# Altium project Soldier.PrjPcb (part 1 of 2)
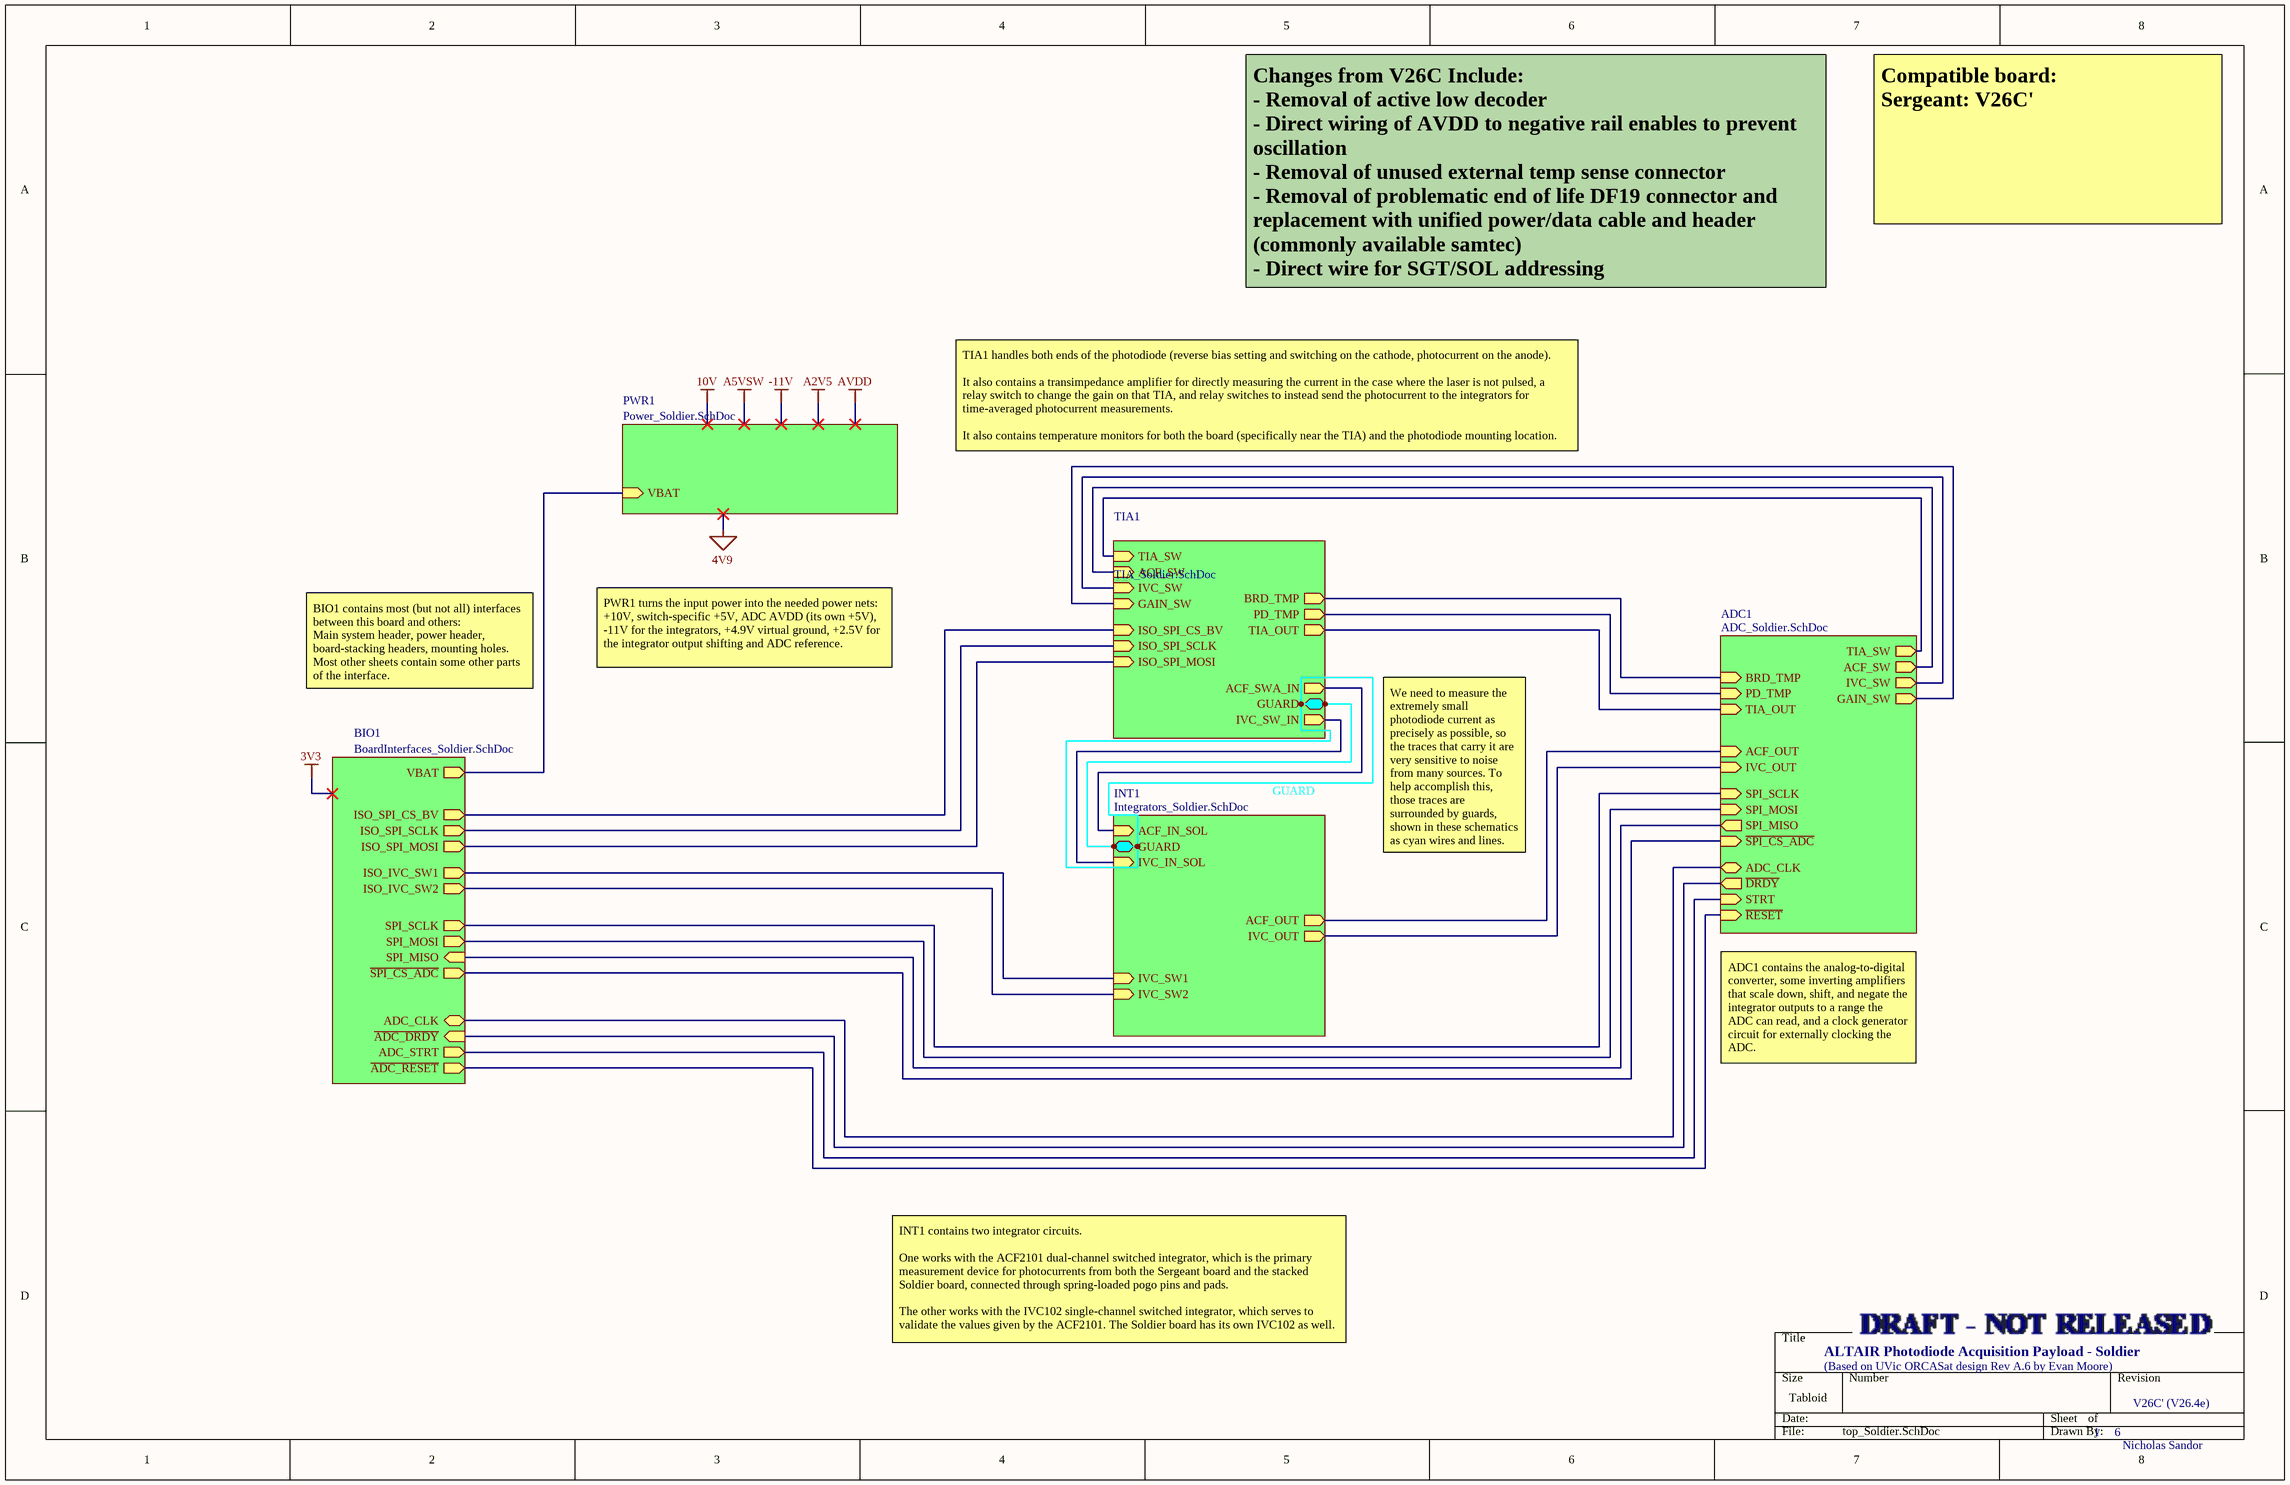
[diagram p0: top_Soldier.SchDoc]
Revision: V26C' (V26.4e); DrawnBy: Nicholas Sandor
6 sheets, 191 parts. Net scope: hierarchical (ports join the sheet entries above them; power ports are global).
Board file: ALTAIR_PD_Soldier_V26.4c.PcbDoc
Sheets:
  top_Soldier.SchDoc
    PWR1 = Power_Soldier.SchDoc
    BIO1 = BoardInterfaces_Soldier.SchDoc
    TIA1 = TIA_Soldier.SchDoc
    INT1 = Integrators_Soldier.SchDoc
    ADC1 = ADC_Soldier.SchDoc

## Sheet top_Soldier.SchDoc
size Tabloid; SheetNumber: 1; SheetTotal: 6

### Sub-sheets
ADC1 = ADC_Soldier.SchDoc: PD_TMP (in), BRD_TMP (in), TIA_OUT (in), ~{SPI_CS_ADC} (in), STRT (in), ACF_OUT (in), IVC_OUT (in), SPI_MOSI (in), SPI_SCLK (in), SPI_MISO (out), ~{DRDY} (out), ~{RESET} (in), ADC_CLK (bidir), GAIN_SW (out), IVC_SW (out), ACF_SW (out), TIA_SW (out)
BIO1 = BoardInterfaces_Soldier.SchDoc: VBAT (out), ADC_CLK (bidir), ~{ADC_DRDY} (in), ADC_STRT (out), ~{ADC_RESET} (out), ISO_SPI_CS_BV (out), ISO_SPI_SCLK (out), ISO_SPI_MOSI (out), ~{SPI_CS_ADC} (out), SPI_MISO (in), SPI_MOSI (out), SPI_SCLK (out), ISO_IVC_SW2 (out), ISO_IVC_SW1 (out)
INT1 = Integrators_Soldier.SchDoc: ACF_IN_SOL (in), IVC_IN_SOL (in), GUARD (bidir), IVC_SW1 (in), IVC_SW2 (in), IVC_OUT (out), ACF_OUT (out)
PWR1 = Power_Soldier.SchDoc: VBAT (in)
TIA1 = TIA_Soldier.SchDoc: IVC_SW_IN (out), ACF_SWA_IN (out), TIA_OUT (out), BRD_TMP (out), PD_TMP (out), GUARD (bidir), TIA_SW (in), ACF_SW (in), IVC_SW (in), GAIN_SW (in), ISO_SPI_CS_BV (in), ISO_SPI_SCLK (in), ISO_SPI_MOSI (in)

### Nets
~{DRDY2}: sheet BIO1/~{ADC_DRDY}, sheet ADC1/~{DRDY}
~{SPI_CS2}: sheet BIO1/~{SPI_CS_ADC}, sheet ADC1/~{SPI_CS_ADC}
ACF_SWA_IN: sheet TIA1/ACF_SWA_IN, sheet INT1/ACF_IN_SOL
ADC_CLK: sheet BIO1/ADC_CLK, sheet ADC1/ADC_CLK
GUARD: sheet TIA1/GUARD, sheet INT1/GUARD
IVC_SW_IN: sheet TIA1/IVC_SW_IN, sheet INT1/IVC_IN_SOL
rSPI_MOSI: sheet BIO1/SPI_MOSI, sheet ADC1/SPI_MOSI
rSPI_SCLK: sheet BIO1/SPI_SCLK, sheet ADC1/SPI_SCLK
SPI_MISO: sheet BIO1/SPI_MISO, sheet ADC1/SPI_MISO
STRT2: sheet BIO1/ADC_STRT, sheet ADC1/STRT
TIA_OUT: sheet TIA1/TIA_OUT, sheet ADC1/TIA_OUT
VBAT: sheet PWR1/VBAT, sheet BIO1/VBAT
NetC32_2: sheet TIA1/BRD_TMP, sheet ADC1/BRD_TMP
NetJ6_3: sheet TIA1/PD_TMP, sheet ADC1/PD_TMP
NetJ9_1: sheet INT1/ACF_OUT, sheet ADC1/ACF_OUT
NetR1_2: sheet BIO1/~{ADC_RESET}, sheet ADC1/~{RESET}
NetR36_2: sheet TIA1/ACF_SW, sheet ADC1/ACF_SW
NetR38_2: sheet TIA1/TIA_SW, sheet ADC1/TIA_SW
NetR39_2: sheet TIA1/IVC_SW, sheet ADC1/IVC_SW
NetR42_2: sheet TIA1/GAIN_SW, sheet ADC1/GAIN_SW
NetU9_1: sheet BIO1/ISO_SPI_CS_BV, sheet TIA1/ISO_SPI_CS_BV
NetU9_2: sheet BIO1/ISO_SPI_SCLK, sheet TIA1/ISO_SPI_SCLK
NetU9_3: sheet BIO1/ISO_SPI_MOSI, sheet TIA1/ISO_SPI_MOSI
NetU12_11: sheet BIO1/ISO_IVC_SW2, sheet INT1/IVC_SW2
NetU12_12: sheet BIO1/ISO_IVC_SW1, sheet INT1/IVC_SW1
NetU15_10: sheet INT1/IVC_OUT, sheet ADC1/IVC_OUT

### Notes on the sheet
- Compatible board:
  Sergeant: V26C'
- Changes from V26C Include:
  - Removal of active low decoder
  - Direct wiring of AVDD to negative rail enables to prevent oscillation
  - Removal of unused external temp sense connector
  - Removal of problematic end of life DF19 connector and replacement with unified power/data cable and header (commonly available samtec)
  - Direct wire for SGT/SOL addressing
- TIA1 handles both ends of the photodiode (reverse bias setting and switching on the cathode, photocurrent on the anode).
  It also contains a transimpedance amplifier for directly measuring the current in the case where the laser is not pulsed, a relay switch to change the gain on that TIA, and relay switches to instead send the photocurrent to the integrators for time-averaged photocurrent measurements.
  It also contains temperature monitors for both the board (specifically near the TIA) and the photodiode mounting location.
- BIO1 contains most (but not all) interfaces between this board and others:
  Main system header, power header, board-stacking headers, mounting holes.
  Most other sheets contain some other parts of the interface.
- PWR1 turns the input power into the needed power nets:
  +10V, switch-specific +5V, ADC AVDD (its own +5V), -11V for the integrators, +4.9V virtual ground, +2.5V for the integrator output shifting and ADC reference.
- GUARD
- We need to measure the extremely small photodiode current as precisely as possible, so the traces that carry it are very sensitive to noise from many sources. To help accomplish this, those traces are surrounded by guards, shown in these schematics as cyan wires and lines.
- ADC1 contains the analog-to-digital converter, some inverting amplifiers that scale down, shift, and negate the integrator outputs to a range the ADC can read, and a clock generator circuit for externally clocking the ADC.
- INT1 contains two integrator circuits.
  One works with the ACF2101 dual-channel switched integrator, which is the primary measurement device for photocurrents from both the Sergeant board and the stacked Soldier board, connected through spring-loaded pogo pins and pads.
  The other works with the IVC102 single-channel switched integrator, which serves to validate the values given by the ACF2101. The Soldier board has its own IVC102 as well.
- ALTAIR Photodiode Acquisition Payload - Soldier
- (Based on UVic ORCASat design Rev A.6 by Evan Moore)

## Sheet Power_Soldier.SchDoc
size Tabloid; SheetNumber: 3; SheetTotal: 6
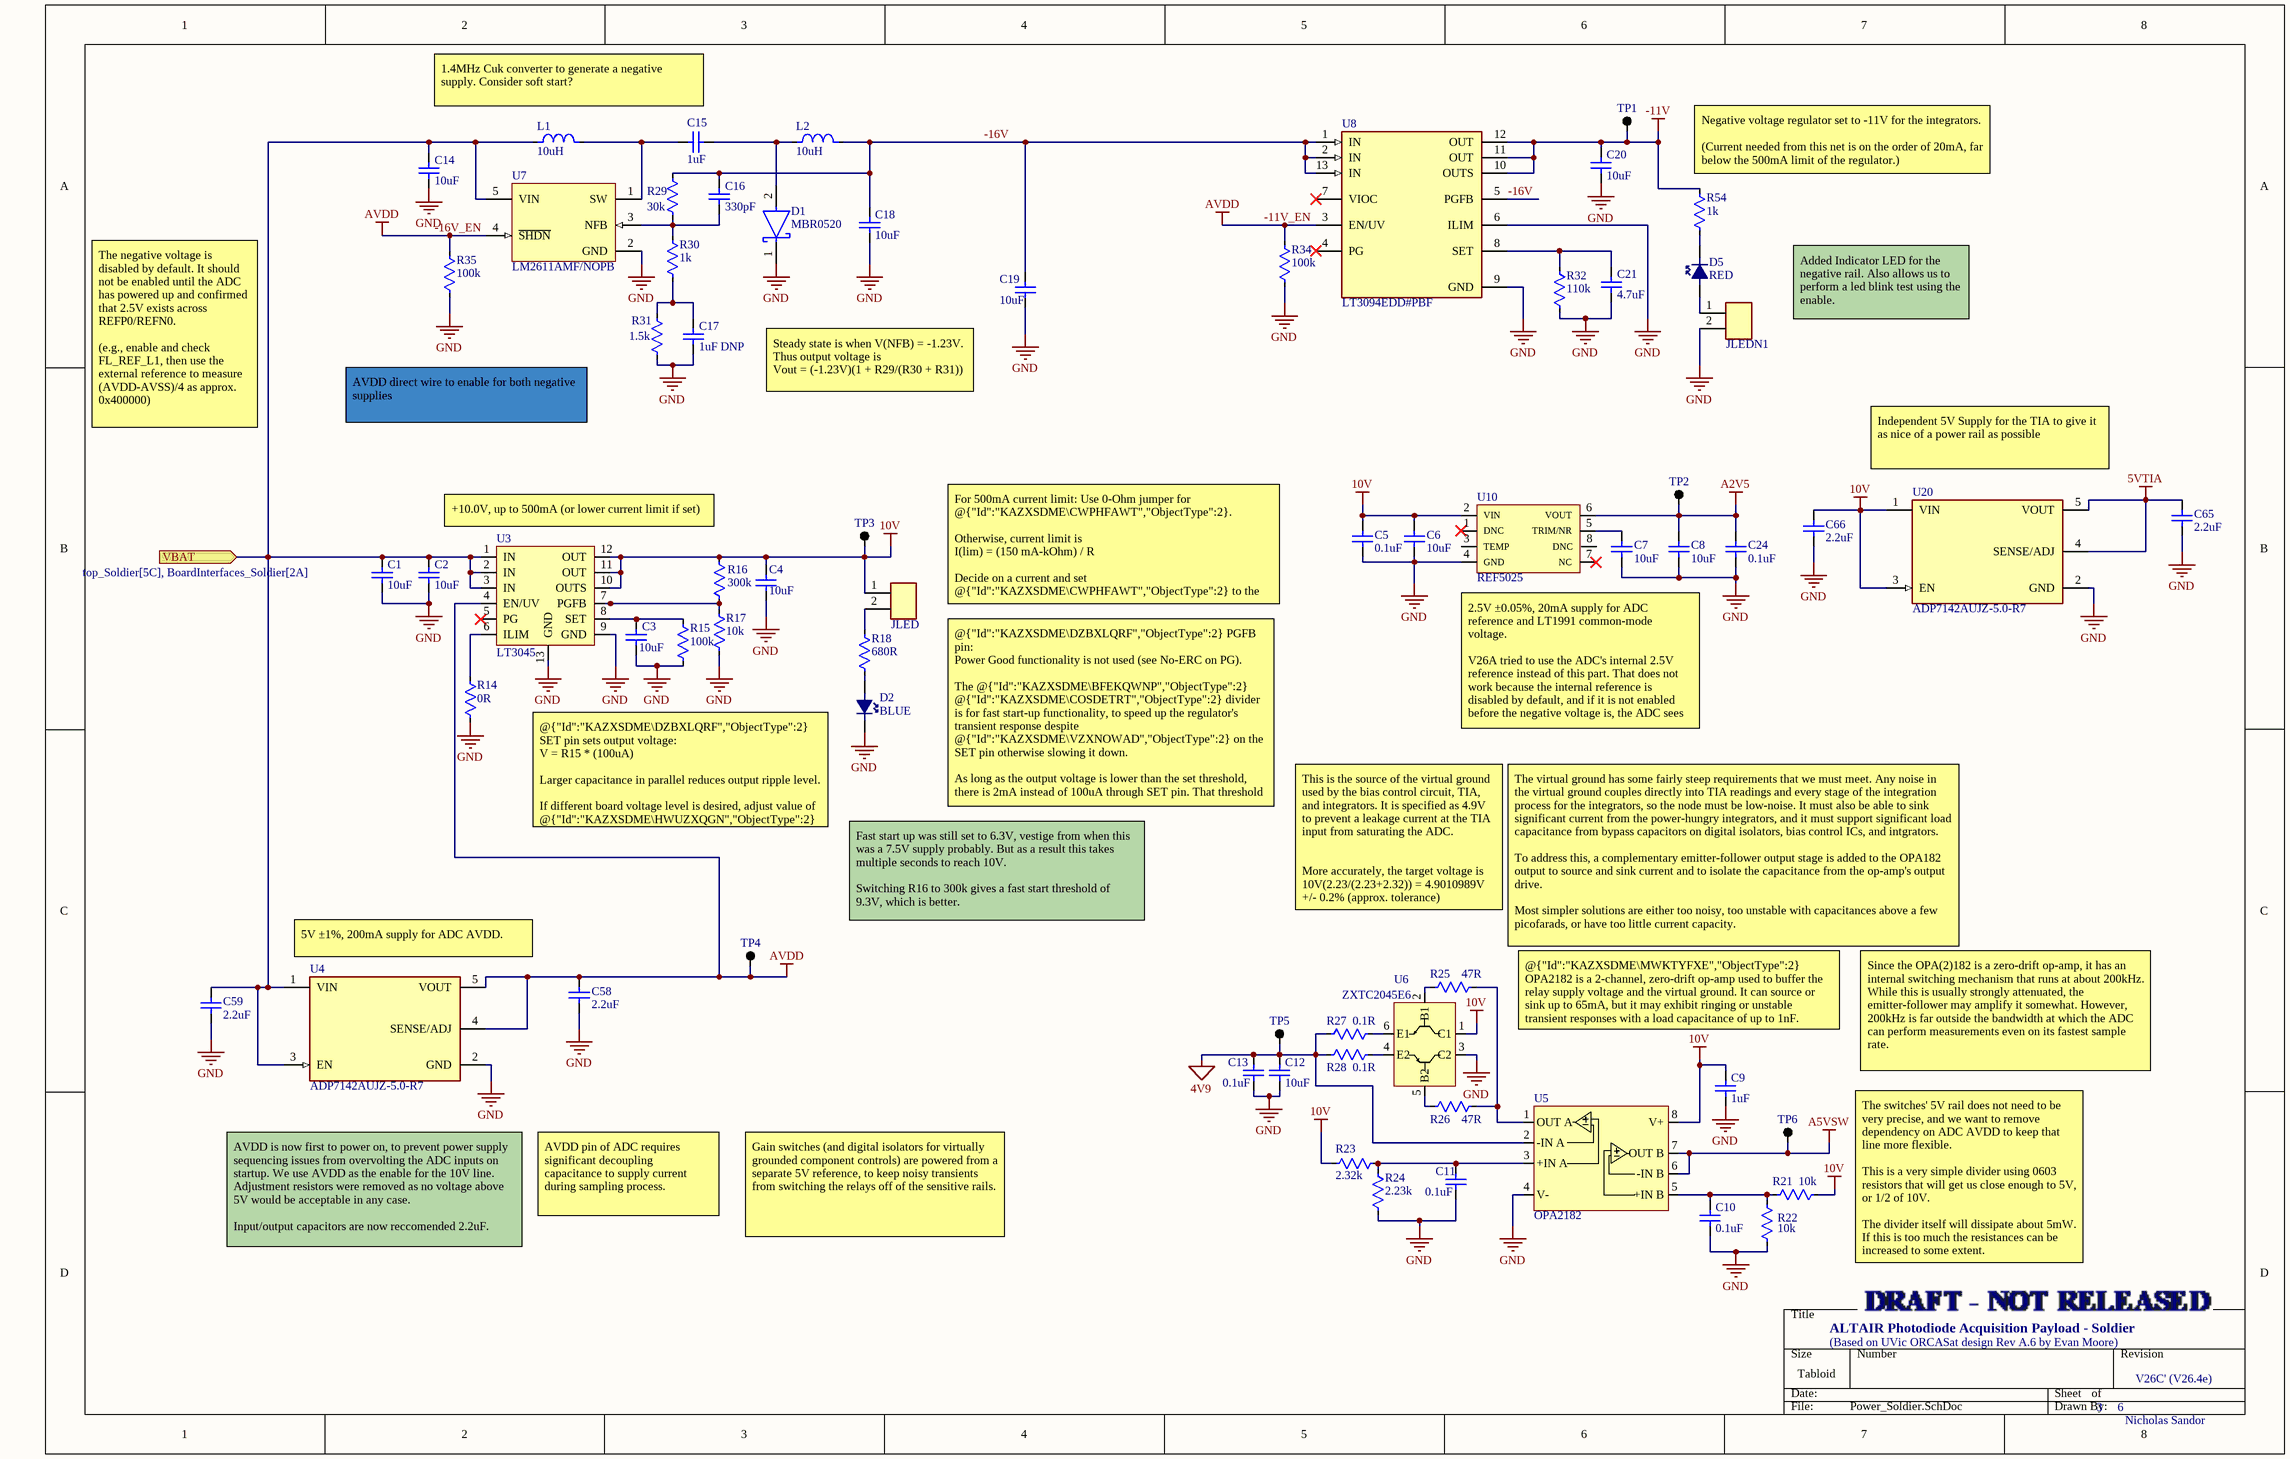
[diagram p1: Power_Soldier.SchDoc]

### Parts
C1  10uF  [CAP 1206 IPC LOW DENSITY]
C2  10uF  [CAP 1206 IPC LOW DENSITY]
C3  10uF  [CAP 1206 IPC LOW DENSITY]
C4  10uF  [CAP 1206 IPC LOW DENSITY]
C5  0.1uF  [CAP 0603 IPC MID DENSITY]
C6  10uF  [CAP 0805 IPC MID DENSITY]
C7  10uF  [CAP 0805 IPC MID DENSITY]
C8  10uF  [CAP 0805 IPC MID DENSITY]
C9  1uF  [CAP 0603 IPC MID DENSITY]
C10  0.1uF  [CAP 0603 IPC MID DENSITY]
C11  0.1uF  [CAP 0603 IPC MID DENSITY]
C12  10uF  [CAP 1206 IPC LOW DENSITY]
C13  0.1uF  [CAP 0603 IPC MID DENSITY]
C14  10uF  [CAP 0805 IPC MID DENSITY]
C15  1uF  [CAP 0603 IPC MID DENSITY]
C16  330pF  [CAP 1206 NON-IPC KEMET NP0]
C17  1uF DNP  [CAP 0603 IPC MID DENSITY]
C18  10uF  [CAP 0805 IPC MID DENSITY]
C19  10uF  [CAP 0805 IPC MID DENSITY]
C20  10uF  [CAP 0805 IPC MID DENSITY]
C21  4.7uF  [CAP 0805 NON-IPC KEMET X5R]
C24  0.1uF  [CAP 0603 IPC MID DENSITY]
C58  2.2uF  [CAP 1206 UNKNOWN]
C59  2.2uF  [CAP 1206 UNKNOWN]
C65  2.2uF  [CAP 1206 UNKNOWN]
C66  2.2uF  [CAP 1206 UNKNOWN]
D1  MBR0520  [SOD-123 ONSEMI SMALL PADS]
D2  BLUE  [LED 0603 MID DENSITY]
D5  RED  [LED 0603 MID DENSITY]
JLED  JLED  [JUMPER 2POS 1MM PITCH THT]  (value not drawn)
JLEDN1  JLED  [JUMPER 2POS 1MM PITCH THT]  (value not drawn)
L1  10uH  [IND VLS3012CX-1 NONSTANDARD TDK]
L2  10uH  [IND VLS3012CX-1 NONSTANDARD TDK]
R14  0R  [RES 0603 IPC MID DENSITY]
R15  100k  [RES 0603 IPC MID DENSITY]
R16  300k  [RES 0603 IPC MID DENSITY]
R17  10k  [RES 0603 IPC MID DENSITY]
R18  680R  [RES 0603 IPC MID DENSITY]
R21  10k  [RES 0603 IPC MID DENSITY]
R22  10k  [RES 0603 IPC MID DENSITY]
R23  2.32k  [RES 0603 IPC MID DENSITY]
R24  2.23k  [RES 0603 IPC MID DENSITY]
R25  47R  [RES 0402 NON-IPC SEI]
R26  47R  [RES 0402 NON-IPC SEI]
R27  0.1R  [RES 0402 NON-IPC YAGEO]
R28  0.1R  [RES 0402 NON-IPC YAGEO]
R29  30k  [RES 0805 IPC HIGH DENSITY]
R30  1k  [RES 0402 IPC LOW DENSITY YAGEO]
R31  1.5k  [RES 1206 NON-IPC VISHAY]
R32  110k  [RES 0603 IPC MID DENSITY]
R34  100k  [RES 0603 IPC MID DENSITY]
R35  100k  [RES 0603 IPC MID DENSITY]
R54  1k  [RES 0603 IPC MID DENSITY]
TP1  Testpoint  [TESTPOINT THT]  (value not drawn)  (no BOM)
TP2  Testpoint  [TESTPOINT THT]  (value not drawn)  (no BOM)
TP3  Testpoint  [TESTPOINT THT]  (value not drawn)  (no BOM)
TP4  Testpoint  [TESTPOINT THT]  (value not drawn)  (no BOM)
TP5  Testpoint  [TESTPOINT THT]  (value not drawn)  (no BOM)
TP6  Testpoint  [TESTPOINT THT]  (value not drawn)  (no BOM)
U3  LT3045  [12-TSOP 0.65MM PITCH 3MM WIDTH EP IPC MID DENSITY]
U4  ADP7142AUJZ-5.0-R7  [SOT23-5 HIGH DENSITY AD]
U5  OPA2182  [8-TSSOP 0.65MM PITCH 4.4MM WIDTH IPC MID DENSITY]
U6  ZXTC2045E6  [SOT23-6 NON-IPC DIODES]
U7  LM2611AMF/NOPB  [SOT23-5 MID DENSITY]
U8  LT3094EDD#PBF  [12DFN 3x3MM EP IPC MID DENSITY]
U10  REF5025  [8-TSOP 0.65MM PITCH 3MM WIDTH IPC MID DENSITY]
U20  ADP7142AUJZ-5.0-R7  [SOT23-5 HIGH DENSITY AD]

### Ports
VBAT (in, see top_Soldier[5C], BoardInterfaces_Soldier[2A])

### Nets
4V9: C12.2 C13.2 R27.1 R28.1 TP5.1 U5.2(-IN_A)
5VTIA: C65.1 U20.4(SENSE/ADJ) U20.5(VOUT)
10V: C4.2 C5.1 C6.2 C9.2 C66.1 JLED.1 R16.2 R21.2 R23.2 TP3.1 U3.10(OUTS) U3.11(OUT) U3.12(OUT) U5.8(V+) U6.1(C1) U10.2(VIN) U20.1(VIN) U20.3(EN)
-11V: C20.1 R54.2 TP1.1 U8.10(OUTS) U8.11(OUT) U8.12(OUT)
-11V_EN: C58.1 R34.1 R35.1 TP4.1 U3.4(EN/UV) U4.4(SENSE/ADJ) U4.5(VOUT) U7.4(~{SHDN}) U8.3(EN/UV)  [also labelled -16V_EN, AVDD]
A2V5: C8.2 C24.1 TP2.1 U10.6(VOUT)
A5VSW: TP6.1 U5.6(-IN_B) U5.7(OUT_B)
GND: C1.1 C2.1 C3.1 C4.1 C5.2 C6.1 C7.2 C8.1 C9.1 C10.1 C11.1 C12.1 C13.1 C14.1 C17.2 C18.2 C19.2 C20.2 C21.2 C24.2 C58.2 C59.2 C65.2 C66.2 D1.1(C) D2.1 JLEDN1.2 R14.1 R15.1 R17.1 R22.1 R24.1 R31.1 R32.2 R34.2 R35.2 U3.9(GND) U3.13(GND) U4.2(GND) U5.4(V-) U6.3(C2) U7.2(GND) U8.6(ILIM) U8.9(GND) U10.4(GND) U20.2(GND)  [project net SYS_GND]
-16V: C16.1 C18.1 C19.1 L2.2 R29.2 U8.1(IN) U8.2(IN) U8.5(PGFB) U8.13(IN)
VBAT: C1.2 C2.2 C14.2 C59.1 L1.1 U3.1(IN) U3.2(IN) U3.3(IN) U4.1(VIN) U4.3(EN) U7.5(VIN) ; port VBAT
NetC3_2: C3.2 R15.2 U3.8(SET)
NetC7_1: C7.1 U10.5(TRIM/NR)
NetC10_2: C10.2 R21.1 R22.2 U5.5(+IN_B)
NetC11_2: C11.2 R23.1 R24.2 U5.3(+IN_A)
NetC15_1: C15.1 L1.2 U7.1(SW)
NetC15_2: C15.2 D1.2(A) L2.1
NetC16_2: C16.2 R29.1 R30.2 U7.3(NFB)
NetC17_1: C17.1 R30.1 R31.2
NetC21_1: C21.1 R32.1 U8.8(SET)
NetD2_2: D2.2 R18.1
NetD5_1: D5.1 R54.1
NetD5_2: D5.2 JLEDN1.1
NetJLED_2: JLED.2 R18.2
NetR14_2: R14.2 U3.6(ILIM)
NetR16_1: R16.1 R17.2 U3.7(PGFB)
NetR25_1: R25.1 U6.2(B1)
NetR25_2: R25.2 R26.2 U5.1(OUT_A)
NetR26_1: R26.1 U6.5(B2)
NetR27_2: R27.2 U6.6(E1)
NetR28_2: R28.2 U6.4(E2)

Not connected (* = marked no-connect by the designer): U3 5(PG)*; U8 4(PG)* 7(VIOC)*; U10 1(DNC)* 3(TEMP) 7(NC)* 8(DNC)

### Notes on the sheet
- 1.4MHz Cuk converter to generate a negative supply. Consider soft start?
- (near R54) Negative voltage regulator set to -11V for the integrators.
  (Current needed from this net is on the order of 20mA, far below the 500mA limit of the regulator.)
- Added Indicator LED for the negative rail. Also allows us to perform a led blink test using the enable.
- The negative voltage is disabled by default. It should not be enabled until the ADC has powered up and confirmed that 2.5V exists across REFP0/REFN0.
  (e.g., enable and check FL_REF_L1, then use the external reference to measure (AVDD-AVSS)/4 as approx. 0x400000)
- AVDD direct wire to enable for both negative supplies
- Steady state is when V(NFB) = -1.23V.
  Thus output voltage is
  Vout = (-1.23V)(1 + R29/(R30 + R31))
- (near U20) Independent 5V Supply for the TIA to give it as nice of a power rail as possible
- +10.0V, up to 500mA (or lower current limit if set)
- For 500mA current limit: Use 0-Ohm jumper for @{"Id":"KAZXSDME\CWPHFAWT","ObjectType":2}.
  Otherwise, current limit is
  I(lim) = (150 mA-kOhm) / R
  Decide on a current and set @{"Id":"KAZXSDME\CWPHFAWT","ObjectType":2} to the found value of R.
- 2.5V ±0.05%, 20mA supply for ADC reference and LT1991 common-mode voltage.
  V26A tried to use the ADC's internal 2.5V reference instead of this part. That does not work because the internal reference is disabled by default, and if it is not enabled before the negative voltage is, the ADC sees dangerously negative voltages on analog inputs.
- @{"Id":"KAZXSDME\DZBXLQRF","ObjectType":2} SET pin sets output voltage:
  V = R15 * (100uA)
  Larger capacitance in parallel reduces output ripple level.
  If different board voltage level is desired, adjust value of @{"Id":"KAZXSDME\HWUZXQGN","ObjectType":2} as necessary according to the above equation.
- @{"Id":"KAZXSDME\DZBXLQRF","ObjectType":2} PGFB pin:
  Power Good functionality is not used (see No-ERC on PG).
  The @{"Id":"KAZXSDME\BFEKQWNP","ObjectType":2} @{"Id":"KAZXSDME\COSDETRT","ObjectType":2} divider is for fast start-up functionality, to speed up the regulator's transient response despite @{"Id":"KAZXSDME\VZXNOWAD","ObjectType":2} on the SET pin otherwise slowing it down.
  As long as the output voltage is lower than the set threshold, there is 2mA instead of 100uA through SET pin. That threshold is
  V(PG) = (0.3V)(1 + R16/R17) - I(PGFB) R56
  Where I(PGFB) is on the order of 1E-8 A.
- (near U4) 5V ±1%, 200mA supply for ADC AVDD.
- Fast start up was still set to 6.3V, vestige from when this was a 7.5V supply probably. But as a result this takes multiple seconds to reach 10V.
  Switching R16 to 300k gives a fast start threshold of 9.3V, which is better.
- This is the source of the virtual ground used by the bias control circuit, TIA, and integrators. It is specified as 4.9V to prevent a leakage current at the TIA input from saturating the ADC.
  More accurately, the target voltage is 10V(2.23/(2.23+2.32)) = 4.9010989V +/- 0.2% (approx. tolerance)
- The virtual ground has some fairly steep requirements that we must meet. Any noise in the virtual ground couples directly into TIA readings and every stage of the integration process for the integrators, so the node must be low-noise. It must also be able to sink significant current from the power-hungry integrators, and it must support significant load capacitance from bypass capacitors on digital isolators, bias control ICs, and intgrators.
  To address this, a complementary emitter-follower output stage is added to the OPA182 output to source and sink current and to isolate the capacitance from the op-amp's output drive.
  Most simpler solutions are either too noisy, too unstable with capacitances above a few picofarads, or have too little current capacity.
- @{"Id":"KAZXSDME\MWKTYFXE","ObjectType":2} OPA2182 is a 2-channel, zero-drift op-amp used to buffer the relay supply voltage and the virtual ground. It can source or sink up to 65mA, but it may exhibit ringing or unstable transient responses with a load capacitance of up to 1nF.
- Since the OPA(2)182 is a zero-drift op-amp, it has an internal switching mechanism that runs at about 200kHz. While this is usually strongly attenuated, the emitter-follower may amplify it somewhat. However, 200kHz is far outside the bandwidth at which the ADC can perform measurements even on its fastest sample rate.
- AVDD pin of ADC requires significant decoupling capacitance to supply current during sampling process.
- AVDD is now first to power on, to prevent power supply sequencing issues from overvolting the ADC inputs on startup. We use AVDD as the enable for the 10V line. Adjustment resistors were removed as no voltage above 5V would be acceptable in any case.
  Input/output capacitors are now reccomended 2.2uF.
- Gain switches (and digital isolators for virtually grounded component controls) are powered from a separate 5V reference, to keep noisy transients from switching the relays off of the sensitive rails.
- (near R21) The switches' 5V rail does not need to be very precise, and we want to remove dependency on ADC AVDD to keep that line more flexible.
  This is a very simple divider using 0603 resistors that will get us close enough to 5V, or 1/2 of 10V.
  The divider itself will dissipate about 5mW. If this is too much the resistances can be increased to some extent.
- ALTAIR Photodiode Acquisition Payload - Soldier
- (Based on UVic ORCASat design Rev A.6 by Evan Moore)

### Library data of the parts
C1-C4 C12 = CAP: Murata GRT319R6YA106KE01D - Cap Ceramic 10uF 35V X5R 10% Pad SMD 1206 85C Automotive T/R; MF: Murata; MP: GRT319R6YA106KE01D
C5 C10 C11 C13 C24 = CAP: Kemet C0603C104K5RACAUTO - Cap Ceramic 0.1uF 50V X7R 10% 0603 125C Paper T/R; MF: Kemet; MP: C0603C104K5RACAUTO
C6-C8 C14 C18-C20 = CAP: Murata GRM21BR61E106KA73L - Cap Ceramic 10uF 10% 25V X5R 0805; MF: Murata; MP: GRM21BR61E106KA73L
C9 C15 C17 = CAP: Murata GRT188R61H105KE13D - Cap MLCC AEC-Q200 X5R 1uF 50V 0603; MF: Murata; MP: GRT188R61H105KE13D
C16 = CAP: Kemet C1206C331J5GACTU - Cap Ceramic 330pF 50V 5% NP0 1206; MF: Kemet; MP: C1206C331J5GACTU
C21 = CAP: Kemet C0805C475K8PACTU - Cap Ceramic 4.7uF 10V X5R 0805; MF: Kemet; MP: C0805C475K8PACTU
C58 C59 C65 C66 = CAP: CL31B225KBHNNNE CAP CER 2.2UF 50V X7R 1206; MF: Samsung Electro-Mechanics; MP: CL31B225KBHNNNE
D1 = Schottky: DIODE SCHOTTKY 20V 500MA SOD123; Polarity: Standard; Peak Non-Repetitive Surge Current: 5.5A; Forward Voltage: 385mV; Element Configuration: Single; Peak Reverse Current: 250uA; MF: onsemi; MP: MBR0520LT1G; Max Repetitive Reverse Voltage (Vrrm): 20V; Voltage Rating (DC): 20V; Case/Package: SOD-123-2; Number of Pins: 2; Output Current: 500mA; Min Operating Temperature: -65°C; Lead Free: Lead Free; REACH SVHC: No SVHC; Max Reverse Voltage (DC): 20V; Termination: SMD/SMT; Average Rectified Current: 500mA; Max Surge Current: 5.5A; Package Quantity: 3000; Height: 1.12mm; Current Rating: 500mA; Forward Current: 500mA; Max Forward Surge Current (Ifsm): 5.5A; Packaging: Tape and Reel; Length: 2.69mm; Radiation Hardening: No; Max Reverse Leakage Current: 250uA; Width: 1.6mm; Contact Plating: Tin; Max Operating Temperature: 125°C
D2 = LED-blue: LED BLUE CLEAR 0603 SMD; Luminous Intensity: 145mcd; Forward Current: 30mA; Forward Voltage: 3.2V; Wavelength: 470nm; Viewing Angle: 140°; Lens Style: Clear,Rectangular; Test Current: 20mA; MF: Wurth Electronics; MP: 150060BS75000; RoHS: Yes; Category: LEDs; Stock 1: 66561; Mount: Surface Mount; Case/Package: 0603; Color: Blue; Case Code (Metric): 1608; Case Code (Imperial): 0603; Min Operating Temperature: -40°C; Max Operating Temperature: 85°C; Package Quantity: 4000; Packaging: Cut Tape; Dominant Wavelength: 470nm; Length: 1.6mm; Height: 0.7mm; Width: 0.8mm; REACH SVHC: Unknown; ComponentLink1URL: https://datasheet.ciiva.com/29563/150060bs75000-29563034.pdf?src-supplier=Digi-Key; ComponentLink1Description: https://datasheet.ciiva.com/29563/150060bs75000-29563034.pdf?src-supplier=Digi-Key; ComponentLink2URL: https://datasheet.ciiva.com/29279/759426-da-01-en-chipled-0603-w-kl-blau-150060bs75000-29279193.pdf?src-supplier=Conrad; ComponentLink2Description: https://datasheet.ciiva.com/29279/759426-da-01-en-chipled-0603-w-kl-blau-150060bs75000-29279193.pdf?src-supplier=Conrad; ComponentLink3URL: https://datasheet.ciiva.com/29563/150060bs75000-29563035.pdf?src-supplier=Digi-Key; ComponentLink3Description: https://datasheet.ciiva.com/29563/150060bs75000-29563035.pdf?src-supplier=Digi-Key; ComponentLink4URL: https://datasheet.ciiva.com/29563/150060bs75000-29563036.pdf?src-supplier=Digi-Key; ComponentLink4Description: https://datasheet.ciiva.com/29563/150060bs75000-29563036.pdf?src-supplier=Digi-Key; ComponentLink5URL: https://datasheet.ciiva.com/22656/1911343-22656939.pdf?src-supplier=Element14; ComponentLink5Description: https://datasheet.ciiva.com/22656/1911343-22656939.pdf?src-supplier=Element14; ComponentLink6URL: https://datasheet.ciiva.com/48430/150060bs75000-eng-tds-48430039.pdf?src-supplier=Distrelec; ComponentLink6Description: https://datasheet.ciiva.com/48430/150060bs75000-eng-tds-48430039.pdf?src-supplier=Distrelec; Supplier 1: Digi-Key; Supplier Part Number 1: 732-4966-1-ND
D5 = LED-blue: LED RED CLEAR 0603 SMD; Color: Blue; Luminous Intensity: 145mcd; Forward Current: 30mA; Forward Voltage: 3.2V; Wavelength: 470nm; Viewing Angle: 140°; Lens Style: Clear,Rectangular; Test Current: 20mA; MF: Wurth Electronics; MP: 150060BS75000; RoHS: Yes; Category: LEDs; Stock 1: 66561; Mount: Surface Mount; Case/Package: 0603; Case Code (Metric): 1608; Case Code (Imperial): 0603; Min Operating Temperature: -40°C; Max Operating Temperature: 85°C; Package Quantity: 4000; Packaging: Cut Tape; Dominant Wavelength: 470nm; Length: 1.6mm; Height: 0.7mm; Width: 0.8mm; REACH SVHC: Unknown; ComponentLink1URL: https://datasheet.ciiva.com/29563/150060bs75000-29563034.pdf?src-supplier=Digi-Key; ComponentLink1Description: https://datasheet.ciiva.com/29563/150060bs75000-29563034.pdf?src-supplier=Digi-Key; ComponentLink2URL: https://datasheet.ciiva.com/29279/759426-da-01-en-chipled-0603-w-kl-blau-150060bs75000-29279193.pdf?src-supplier=Conrad; ComponentLink2Description: https://datasheet.ciiva.com/29279/759426-da-01-en-chipled-0603-w-kl-blau-150060bs75000-29279193.pdf?src-supplier=Conrad; ComponentLink3URL: https://datasheet.ciiva.com/29563/150060bs75000-29563035.pdf?src-supplier=Digi-Key; ComponentLink3Description: https://datasheet.ciiva.com/29563/150060bs75000-29563035.pdf?src-supplier=Digi-Key; ComponentLink4URL: https://datasheet.ciiva.com/29563/150060bs75000-29563036.pdf?src-supplier=Digi-Key; ComponentLink4Description: https://datasheet.ciiva.com/29563/150060bs75000-29563036.pdf?src-supplier=Digi-Key; ComponentLink5URL: https://datasheet.ciiva.com/22656/1911343-22656939.pdf?src-supplier=Element14; ComponentLink5Description: https://datasheet.ciiva.com/22656/1911343-22656939.pdf?src-supplier=Element14; ComponentLink6URL: https://datasheet.ciiva.com/48430/150060bs75000-eng-tds-48430039.pdf?src-supplier=Distrelec; ComponentLink6Description: https://datasheet.ciiva.com/48430/150060bs75000-eng-tds-48430039.pdf?src-supplier=Distrelec; Supplier 1: Digi-Key; Supplier Part Number 1: 732-4966-1-ND
JLED JLEDN1 = BC020-02-A-0200-0300-L-G: 2x1 Header THT 1mm Pitch; MF: GCT (GLOBAL CONNECTOR TECHNOLOGY); Datasheet Link: https://gct.co/connector/bc020; MP: BC020-02-A-0200-0300-L-G; Mouser Part Number: 640-BC02002A02300LG; Mouser Price/Stock: https://www.mouser.co.uk/ProductDetail/GCT/BC020-02-A-0200-0300-L-G?qs=KUoIvG%2F9IlakgsojlT9P9w%3D%3D
L1 L2 = IND: TDK VLS3012CX-100M-1 - Inductor 10uH 20% 1.25A 0.324Ohm NonstandardPkg; DC Resistance (DCR): 324mR; Core Material: Ferrite; Saturation Current: 1A; Test Frequency: 100kHz; MF: TDK Corporation; Inductance: 10uH; Height: 1.20mm; Width: 3.00mm; Inductance Tolerance: 20%; Lead Free: Lead Free; Length: 3.00mm; Max Operating Temperature: 105°C; Resistor Type: Wirewound; Height - Seated (Max): 0.047inch; Series: VLS-CX-1; Packaging: Tape and Reel; Number of Pins: 2; Tolerance: 20%; Mount: Surface Mount; Max DC Current: 1.25A; Min Operating Temperature: -40°C; Termination: SMD/SMT; MP: VLS3012CX-100M-1
R14 = RES: Vishay CRCW06030000Z0EA - Res 0 Ohms 1/8W SMD 0603; MF: Vishay Dale; MP: CRCW06030000Z0EA
R15 = RES: Panasonic ERA-3ARB104V - Res SMD 0603 0.1% 0.10W T.C. 10ppm 100K; MF: Panasonic Electronic Components; MP: ERA-3ARB104V
R16 = RES: Vishay MCT06030C3003FP500 - Res SMD 300kOhm 1% 1/10W 0603; MF: Vishay Dale; MP: MCT06030C3003FP500
R17 R21 R22 = RES: Vishay CRCW060310K0FKEA SMD 0603 10k, CRCW e3 Series, 75V, thick film, 100mW; MF: Vishay Dale; MP: CRCW060310K0FKEA
R18 = RES: Panasonic ERJ-3EKF6800V - Res SMD 680 Ohm 1% 1/10W 0603; MF: Panasonic Electronic Components; MP: ERJ-3EKF6800V
R23 = RES: Vishay TNPW06032K32BEEA - Res 2.32k 0.1% 0.21W SMD 0603; MF: Vishay Dale; MP: TNPW06032K32BEEA
R24 = RES: KOA Speer RN73R1JTTD2231B25 - Res 2.23k 0.1% 1/10W SMD 0603; MF: KOA Speer Electronics, Inc.; MP: RN73R1JTTD2231B25
R25 R26 = RES: Stackpole RMCF0402JT47R0 - Res 47Ohm 5% 0.063W 0402 Thick Film AEC-Q200 compliant; MF: Stackpole Electronics Inc.; MP: RMCF0402JT47R0
R27 R28 = RES: Yageo RL0402JR-070R1L - Res 0.1Ohm 5% 1/16W SMD 0402; MF: YAGEO; MP: RL0402JR-070R1L
R29 = RES: Panasonic ERA-6AEB303V - Res 30kOhm 0.1% 1/8W 0805; MF: Panasonic Electronic Components; MP: ERA-6AEB303V
R30 = RES: Yageo RC0402FR-071KL - Res 1kOhm 1% 1/16W 0402; MF: YAGEO; MP: RC0402FR-071KL
R31 = RES: Vishay TNPU12061K50BZEN00 - Res 1.5kOhm 0.1% 1/4W 1206; MF: Vishay Dale; MP: TNPU12061K50BZEN00
R32 = RES: Panasonic ERA-3AEB114V - Res 110k 0.1% 1/10W SMD 0603; MF: Panasonic Electronic Components; MP: ERA-3AEB114V
R34 R35 = RES: Panasonic ERJ-3GEYJ104V - Res 100k 5% 1/10W SMD 0603; MF: Panasonic Electronic Components; MP: ERJ-3GEYJ104V
R54 = RES: Panasonic ERJ-U03F1001V - Res SMD 1 kOhm 1% 1/10W 0603; MF: Panasonic Electronic Components; MP: ERJ-U03F1001V
U3 = LT3045: 20V 500mA Ultralow Noise Ultrahigh PSRR Adjustable Linear Regulator 260V Dropout MSOP-12; Output Voltage: 15V; Dropout Voltage: 260mV; Number of Regulators: 1; Min Current Limit: 570mA; MF: Analog Devices / Linear Technology; MP: LT3045EMSE#PBF; RoHS: Yes; Stock 1: 1588; Case/Package: MSOP; Min Operating Temperature: -40°C; Max Operating Temperature: 125°C; Output Current: 500mA; ComponentLink1URL: http://www.farnell.com/datasheets/2163219.pdf?src-supplier=Farnell; ComponentLink1Description: http://www.farnell.com/datasheets/2163219.pdf?src-supplier=Farnell; ComponentLink2URL: http://www.linear.com/docs/55649?src-supplier=Digi-Key; ComponentLink2Description: http://www.linear.com/docs/55649?src-supplier=Digi-Key; Supplier 1: Digi-Key; Supplier Part Number 1: LT3045EMSE#PBF-ND
U4 U20 = ADP7142AUJZ-R7: 1.2-40V 200mA Low Noise CMOS LDO Adjustable Linear Regulator TSOT23; Nominal Supply Current: 50-180uA; Output Type: AdjustableProgrammable; Max Supply Voltage: 40V; Number Of Outputs: 1; Dropout Voltage: 200mV; Output Voltage: 1.2-5V; Min Supply Voltage: 2.7V; Max Junction Temp: +150°C; MF: Analog Devices; Accuracy Percentage: 0.8%; Ambient Temperature Range Low: -40°C; ComponentLink2Description: Datasheet; Digikey Description: IC REG LIN POS ADJ 200MA TSOT23; Device Class L1: Integrated Circuits (ICs); Mouser Description: LDO Regulator Pos 1.5V to 5V 0.2A 5-Pin TSOT-23 T/R; Height: 1mm; Temperature Range Low: -40°C; Output Current: 200mA; Device Class L3: Voltage Regulators - Linear; Octopart: https://octopart.com/adp7142aujz-r7-analog+devices-38928114; Category: IC; MP: ADP7142AUJZ-5.0-R7; ComponentLink2URL: https://www.analog.com/media/en/technical-documentation/data-sheets/ADP7142.pdf; Device Class L2: Power Management ICs; Package: UJ-5; Automotive: No; Lead Free: Yes; Ambient Temperature Range High: +125°C; Temperature: -40°C to +125°C; Temperature Range High: +125°C; RoHS: TRUE; Manufacturer: Analog Devices; Manufacturer Part Number: ADP7142AUJZ-R7
U5 = OPA2182IDBV: Op amp, 2 Channel, Highest-precision, 36-V, 5-MHz, single, low-noise, zero-drift, MUX-friendly amplifier 8VSSOP -40 to 125; MF: Texas Instruments; MP: OPA2182IDGKR
U6 = ZXTC2045E6: BJT Array, 1NPN 1PNP, VCE(sat) 375mV, hFE 300, Breakdown 30V, 6-SOT-23; MF: Diodes Incorporated; MP: ZXTC2045E6TA
U7 = LM2611AMF: 1.4MHz Cuk Converter, 5-pin SOT-23, Pb-Free; PowerWise: N; CompType: Switcher; PackageTopMarking: S40A*XTT; MF: Texas Instruments; ComponentLink1URL: http://www.ti.com/general/docs/lit/getliterature.tsp?genericPartNumber=LM2611&fileType=pdf; PackageDescription: Molded SOT-23, .115 x .063 x .040 in Body, 5 Lead, .0375 in Pitch; ComponentLink1Description: Datasheet URL; PackageReference: DBV0005A; PinCount: 5; RoHS: Y; MP: LM2611AMF/NOPB
U8 = LT3094EDD#PBF: -20V 500mA Ultralow Noise Ultrahigh PSRR Adjustable Negative Linear Regulator 12DFN; MF: Analog Devices; RoHS Compliant: Yes; MP: LT3094EDD#PBF
U10 = REF5050IDGKR: 2.5V±0.05% Voltage Reference 8VSSOP; MF: Texas Instruments; MP: REF5025IDGKR; Number of Channels: 1; Max Input Voltage: 18V; Output Voltage: 5V; Min Input Voltage: 5.2V; Nominal Supply Current: 800uA; Tolerance: 0.05%; Max Output Current: 10mA; Operating Supply Current: 1.2mA; Temperature Coefficient: 3ppm/°C; Reference Type: Series; Output Type: Fixed; Supplier 1: Digi-Key; RoHS: Yes; Category: Voltage References; Stock 1: 2539; Pricing 1: 1=6.18000, 10=5.58100, 25=5.32200, 100=4.41320, 250=4.02380, 500=3.76420, 1000=3.45268 (USD); Case/Package: VSSOP; Number of Pins: 8; Weight: 0.00067oz; Min Operating Temperature: -40°C; Max Operating Temperature: 125°C; Packaging: Tape and Reel; Package Quantity: 1; Min Output Voltage: 5V; Output Current: 10mA; Max Output Voltage: 5V; Quiescent Current: 800uA; Radiation Hardening: No; Lead Free: Lead Free; ComponentLink1URL: https://datasheet.ciiva.com/2007/ref5020-2007532.pdf?src-supplier=Digi-Key; ComponentLink1Description: https://datasheet.ciiva.com/2007/ref5020-2007532.pdf?src-supplier=Digi-Key; ComponentLink2URL: https://datasheet.ciiva.com/14197/ref5050-14197084.pdf?src-supplier=Avnet; ComponentLink2Description: https://datasheet.ciiva.com/14197/ref5050-14197084.pdf?src-supplier=Avnet; ComponentLink3URL: https://datasheet.ciiva.com/2007/ref5020-2007533.pdf?src-supplier=Digi-Key; ComponentLink3Description: https://datasheet.ciiva.com/2007/ref5020-2007533.pdf?src-supplier=Digi-Key; ComponentLink4URL: https://datasheet.ciiva.com/2007/ref5020-2007534.pdf?src-supplier=Digi-Key; ComponentLink4Description: https://datasheet.ciiva.com/2007/ref5020-2007534.pdf?src-supplier=Digi-Key; ComponentLink5URL: https://datasheet.ciiva.com/41462/001014471-da-01-en-ic-vref-series-ref5050idgkr-vssop-8-tid-41462326.pdf?src-supplier=Conrad; ComponentLink5Description: https://datasheet.ciiva.com/41462/001014471-da-01-en-ic-vref-series-ref5050idgkr-vssop-8-tid-41462326.pdf?src-supplier=Conrad; Supplier Part Number 1: 296-27505-1-ND

## Sheet BoardInterfaces_Soldier.SchDoc
size Tabloid; SheetNumber: 2; SheetTotal: 6
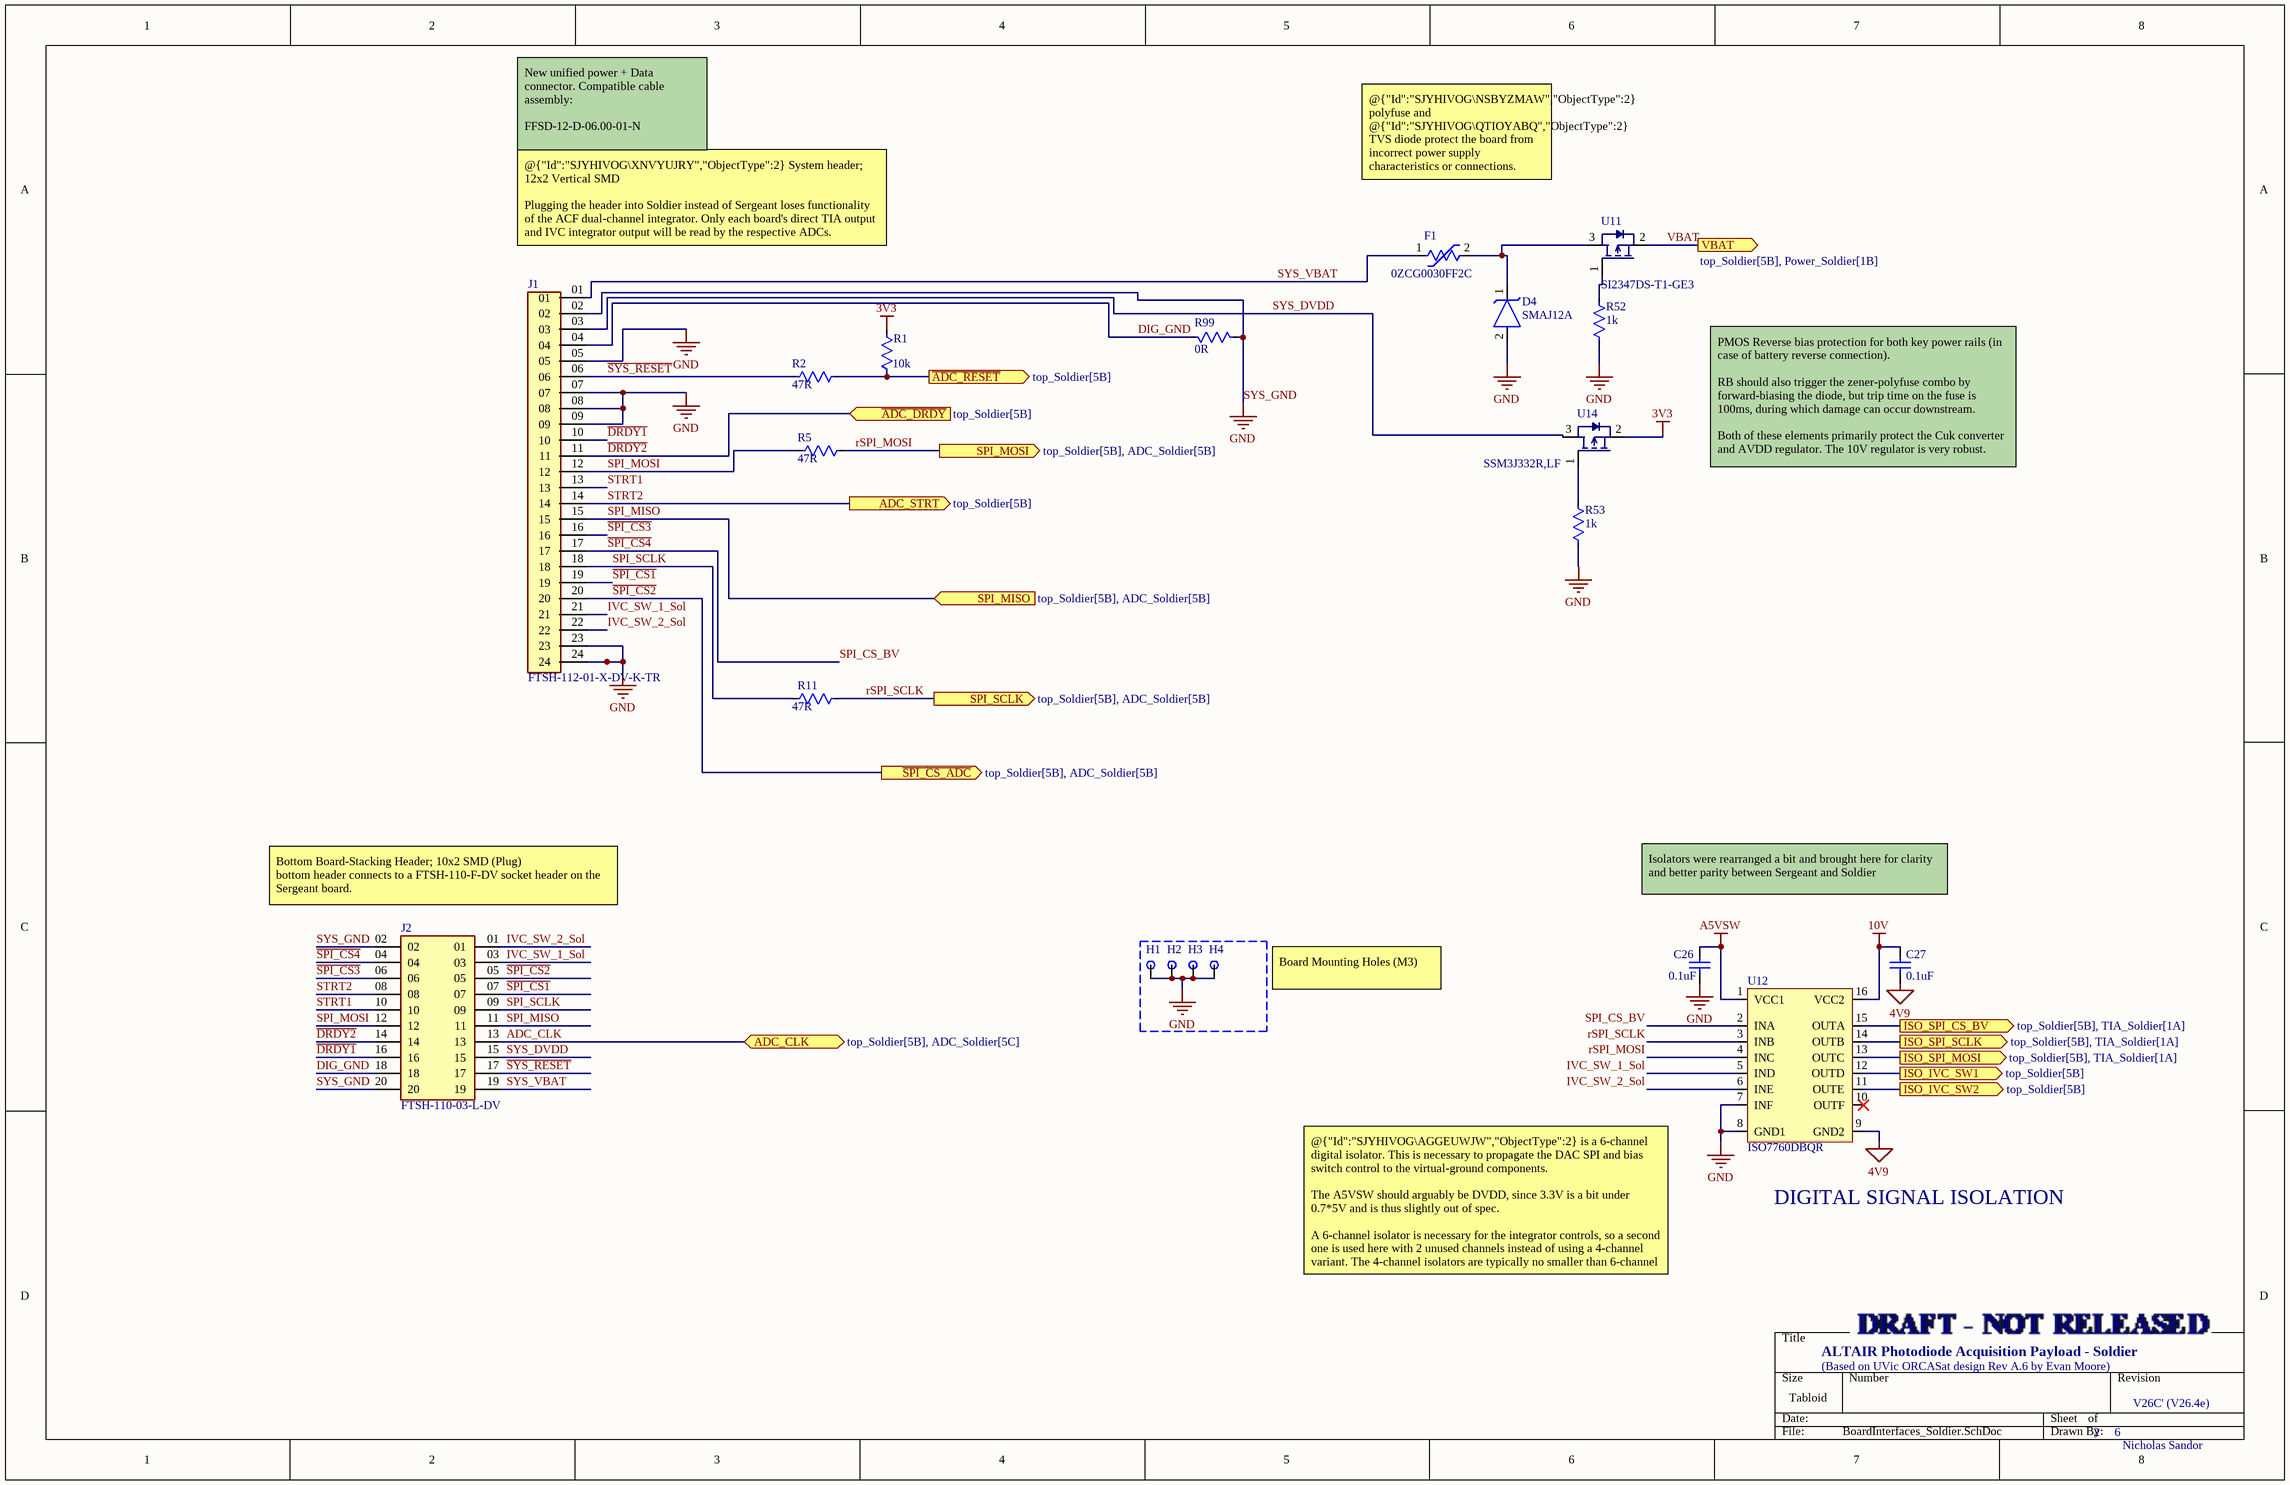
[diagram p2: BoardInterfaces_Soldier.SchDoc]

### Parts
C26  0.1uF  [CAP 0603 IPC MID DENSITY]
C27  0.1uF  [CAP 0603 IPC MID DENSITY]
D4  SMAJ12A  [DO-214AC SMA VISHAY]
F1  0ZCG0030FF2C  [POLYFUSE 1812 NON-IPC BELFUSE]
H1  Mount-hole  [M3 PTH FOR 4.5MM HEX]  (value not drawn)  (no BOM)
H2  Mount-hole  [M3 PTH FOR 4.5MM HEX]  (value not drawn)  (no BOM)
H3  Mount-hole  [M3 PTH FOR 4.5MM HEX]  (value not drawn)  (no BOM)
H4  Mount-hole  [M3 PTH FOR 4.5MM HEX]  (value not drawn)  (no BOM)
J1  FTSH-112-01-X-DV-K-TR  [SAMTEC_FTSH-112-01-X-DV-K-TR]
J2  FTSH-110-03-L-DV  [HEADER MALE 10X2 1.27MM PITCH FTSH]
R1  10k  [RES 0603 IPC MID DENSITY]
R2  47R  [RES 0402 NON-IPC SEI]
R5  47R  [RES 0402 NON-IPC SEI]
R11  47R  [RES 0402 NON-IPC SEI]
R52  1k  [RES 0603 IPC MID DENSITY]
R53  1k  [RES 0603 IPC MID DENSITY]
R99  0R  [RES 0402 IPC MID DENSITY]
U11  SI2347DS-T1-GE3  [SOT95P245X110-3N]
U12  ISO7760DBQR  [16-SSOP 0.635MM PITCH 5.4MM WIDTH NON-IPC TI]
U14  SSM3J332R,LF  [SOT95P245X110-3N]

### Ports
ADC_CLK (bidir, see top_Soldier[5B], ADC_Soldier[5C]), ADC_STRT (out, see top_Soldier[5B]), ISO_IVC_SW1 (out, see top_Soldier[5B]), ISO_IVC_SW2 (out, see top_Soldier[5B]), ISO_SPI_CS_BV (out, see top_Soldier[5B], TIA_Soldier[1A]), ISO_SPI_MOSI (out, see top_Soldier[5B], TIA_Soldier[1A]), ISO_SPI_SCLK (out, see top_Soldier[5B], TIA_Soldier[1A]), SPI_MISO (in, see top_Soldier[5B], ADC_Soldier[5B]), SPI_MOSI (out, see top_Soldier[5B], ADC_Soldier[5B]), SPI_SCLK (out, see top_Soldier[5B], ADC_Soldier[5B]), VBAT (out, see top_Soldier[5B], Power_Soldier[1B]), ~{ADC_DRDY} (in, see top_Soldier[5B]), ~{ADC_RESET} (out, see top_Soldier[5B]), ~{SPI_CS_ADC} (out, see top_Soldier[5B], ADC_Soldier[5B])

### Nets
3V3: R1.1 U14.2(Source)
4V9: C27.1 U12.9(GND2)
10V: C27.2 U12.16(VCC2)
A5VSW: C26.2 U12.1(VCC1)
SYS_GND: C26.1 D4.2(Anode) H1.1 H2.1 H3.1 H4.1 J1.02 J1.05 J1.07 J1.08 J1.09 J1.23 J1.24 J2.02 J2.20 R52.1 R53.1 R99.1 U12.7(INF) U12.8(GND1)  [also labelled GND]
~{DRDY1}: J1.10 J2.16
~{DRDY2}: J1.11 J2.14 ; port ~{ADC_DRDY}
~{SPI_CS1}: J1.19 J2.07
~{SPI_CS2}: J1.20 J2.05 ; port ~{SPI_CS_ADC}
~{SPI_CS3}: J1.16 J2.06
~{SPI_CS4}: J1.17 J2.04 U12.2(INA)  [also labelled SPI_CS_BV]
~{SYS_RESET}: J1.06 J2.17 R2.1
ADC_CLK: J2.13 ; port ADC_CLK
DIG_GND: J1.04 J2.18 R99.2
IVC_SW_1_Sol: J1.21 J2.03 U12.5(IND)
IVC_SW_2_Sol: J1.22 J2.01 U12.6(INE)
rSPI_MOSI: R5.2 U12.4(INC) ; port SPI_MOSI
rSPI_SCLK: R11.2 U12.3(INB) ; port SPI_SCLK
SPI_MISO: J1.15 J2.11 ; port SPI_MISO
SPI_MOSI: J1.12 J2.12 R5.1
SPI_SCLK: J1.18 J2.09 R11.1
STRT1: J1.13 J2.10
STRT2: J1.14 J2.08 ; port ADC_STRT
SYS_DVDD: J1.03 J2.15 U14.3(Drain)
SYS_VBAT: F1.1 J1.01 J2.19
VBAT: U11.2(Source) ; port VBAT
NetD4_1: D4.1(Cathode) F1.2 U11.3(Drain)
NetR1_2: R1.2 R2.2 ; port ~{ADC_RESET}
NetR52_2: R52.2 U11.1(Gate)
NetR53_2: R53.2 U14.1(Gate)
NetU9_1: U12.15(OUTA) ; port ISO_SPI_CS_BV
NetU9_2: U12.14(OUTB) ; port ISO_SPI_SCLK
NetU9_3: U12.13(OUTC) ; port ISO_SPI_MOSI
NetU12_11: U12.11(OUTE) ; port ISO_IVC_SW2
NetU12_12: U12.12(OUTD) ; port ISO_IVC_SW1

Not connected (* = marked no-connect by the designer): U12 10(OUTF)*

### Notes on the sheet
- New unified power + Data connector. Compatible cable assembly:
  FFSD-12-D-06.00-01-N
- @{"Id":"SJYHIVOG\NSBYZMAW","ObjectType":2} polyfuse and @{"Id":"SJYHIVOG\QTIOYABQ","ObjectType":2} TVS diode protect the board from incorrect power supply characteristics or connections.
  Rated for up to 14V and 300mA.
- (near J1) @{"Id":"SJYHIVOG\XNVYUJRY","ObjectType":2} System header; 12x2 Vertical SMD
  Plugging the header into Soldier instead of Sergeant loses functionality of the ACF dual-channel integrator. Only each board's direct TIA output and IVC integrator output will be read by the respective ADCs.
- PMOS Reverse bias protection for both key power rails (in case of battery reverse connection).
  RB should also trigger the zener-polyfuse combo by forward-biasing the diode, but trip time on the fuse is 100ms, during which damage can occur downstream.
  Both of these elements primarily protect the Cuk converter and AVDD regulator. The 10V regulator is very robust.
- (near J2) Bottom Board-Stacking Header; 10x2 SMD (Plug)
  bottom header connects to a FTSH-110-F-DV socket header on the Sergeant board.
- Isolators were rearranged a bit and brought here for clarity and better parity between Sergeant and Soldier
- Board Mounting Holes (M3)
- DIGITAL SIGNAL ISOLATION
- @{"Id":"SJYHIVOG\AGGEUWJW","ObjectType":2} is a 6-channel digital isolator. This is necessary to propagate the DAC SPI and bias switch control to the virtual-ground components.
  The A5VSW should arguably be DVDD, since 3.3V is a bit under 0.7*5V and is thus slightly out of spec.
  A 6-channel isolator is necessary for the integrator controls, so a second one is used here with 2 unused channels instead of using a 4-channel variant. The 4-channel isolators are typically no smaller than 6-channel isolators.
- ALTAIR Photodiode Acquisition Payload - Soldier
- (Based on UVic ORCASat design Rev A.6 by Evan Moore)

### Library data of the parts
C26 C27 = CAP: as C5 on sheet Power_Soldier; MF: Kemet; MP: C0603C104K5RACAUTO
D4 = Zener: Vishay SMAJ12A-M3/61 - TVS Diode 12V Standoff 13.3V Breakdown DO-214AC; MF: Vishay General Semiconductor; MP: SMAJ12A-M3/61
F1 = Polyfuse: Bel Fuse 0ZCG0030FF2C - Polymeric PTC Resettable Fuse 30V 300mA hold 600mA trip SMD 1812; MF: Bel Fuse Inc.; MP: 0ZCG0030FF2C
H1-H4 = Mount-hole: (Plated) Mounting hole
J1 = FTSH-112-01-X-DV-K-TR: MF: {'manufacturer': u'Samtec'}; Package: None; Price: None; Value: *; MP: FTSH-112-01-X-DV-K-TR; Availability: Unavailable
J2 = CLP-110-02-X-D: 10x2 Position Pin Connector 0.050 (1.27mm) Surface Mount, Gold; Alt parts FTSH-110-03-F-DV (thinner gold), FTSH-110-03-F-DV-P (thinner gold + pick and place); MF: Samtec; MP: FTSH-110-03-L-DV
R1 = RES: as R17 on sheet Power_Soldier; MP: CRCW060310K0FKEA
R2 R5 R11 = RES: as R25 on sheet Power_Soldier; MP: RMCF0402JT47R0
R52 R53 = RES: Panasonic ERJ-U03F1001V - Res SMD 1 kOhm 1% 1/10W 0603; MF: Panasonic; MP: ERJ-U03F1001V
R99 = RES: Yageo RC0402JR-070RL - Res 0 Ohms 1/16W SMD 0402; MF: YAGEO; MP: RC0402JR-070RL
U11 = PMOS: MOSFET P-CH 30V 5A SOT23-3; Supplier 1: Avnet; Supplier Part Number 1: SI2347DS-T1-GE3
U12 = ISO7760DBQR: Digital Isolator 6-Channel 6/0 Inputs 16SSOP; MF: Texas Instruments; MP: ISO7760DBQR
U14 = PMOS_LV: P-Channel 30 V 6A (Ta) 1W (Ta) Surface Mount SOT-23F; Supplier 1: Avnet; Supplier Part Number 1: SI2347DS-T1-GE3

## Sheet TIA_Soldier.SchDoc
size Tabloid; DrawnBy: Nicholas Sandor; Revision: V26C (V26.4a); SheetNumber: 4; SheetTotal: 6
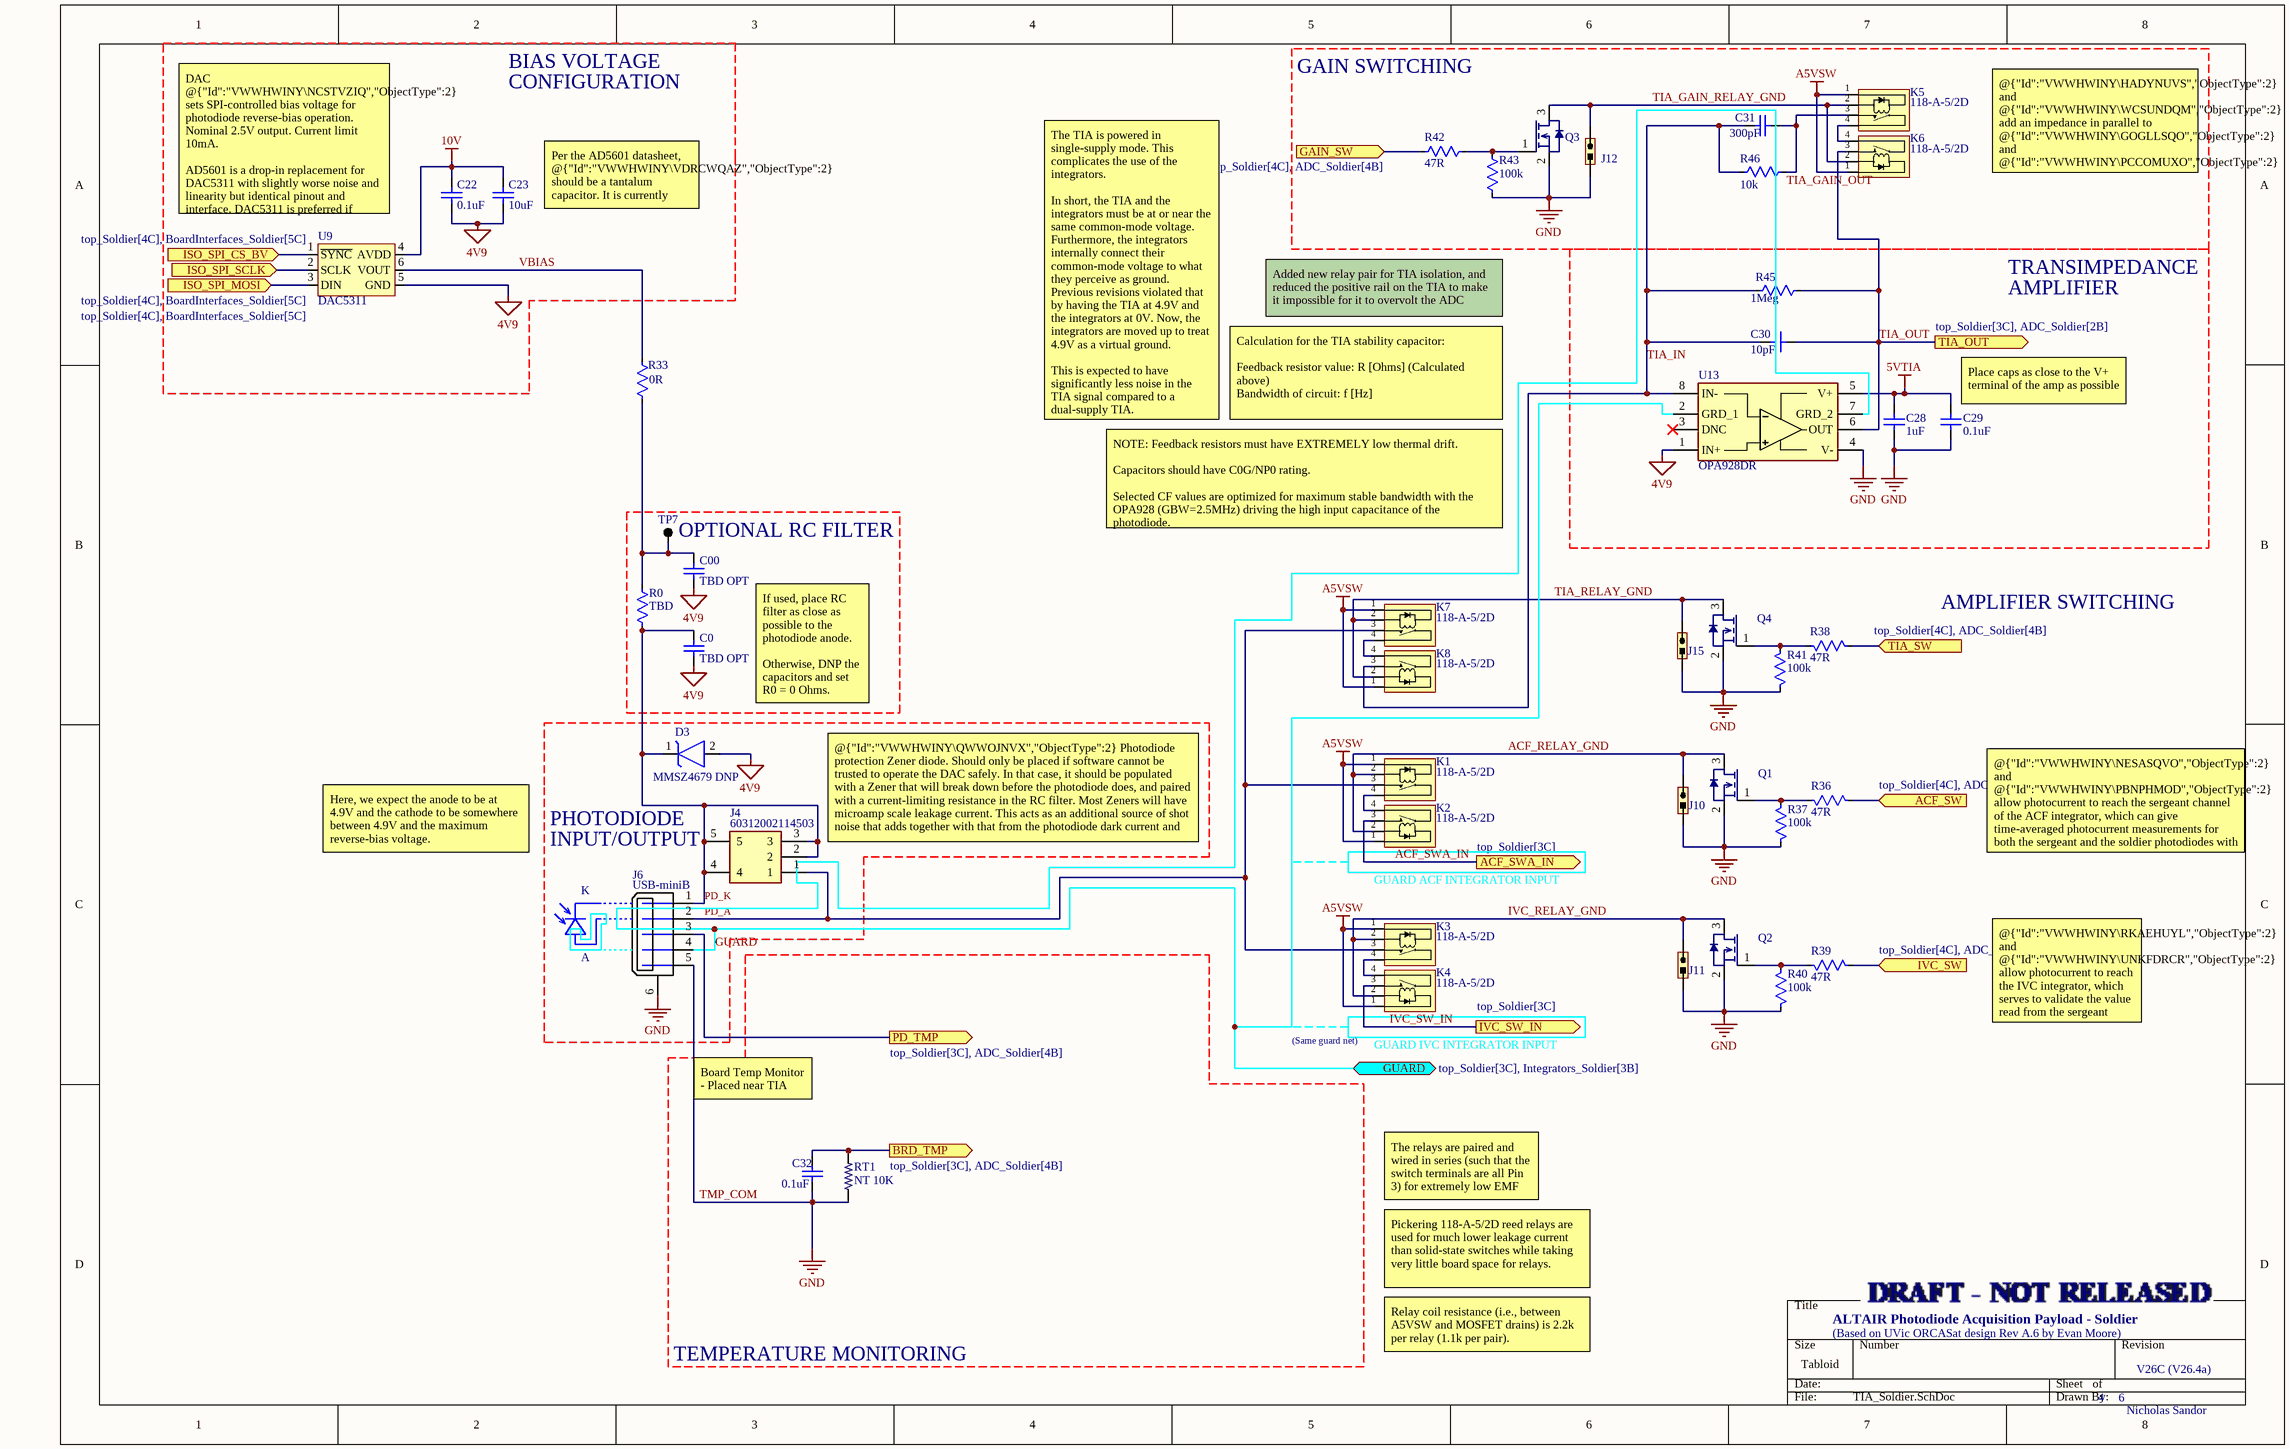
[diagram p3: TIA_Soldier.SchDoc]

### Parts
C00  TBD OPT  [CAP 0603 IPC MID DENSITY]
C0  TBD OPT  [CAP 0603 IPC MID DENSITY]
C22  0.1uF  [CAP 0603 IPC MID DENSITY]
C23  10uF  [CAP 1206 IPC LOW DENSITY]
C28  1uF  [CAP 0603 IPC MID DENSITY]
C29  0.1uF  [CAP 0603 IPC MID DENSITY]
C30  10pF  [CAP 1206 UNKNOWN]
C31  300pF  [CAP 1206 NON-IPC KEMET NP0]
C32  0.1uF  [CAP 0603 IPC MID DENSITY]
D3  MMSZ4679 DNP  [SOD-123 ONSEMI SMALL PADS]
J4  60312002114503  [COAX SMA THT]
J6  USB-miniB  [USB-miniB]
J10  Jumper  [JUMPER 2POS 1MM PITCH THT]  (value not drawn)
J11  Jumper  [JUMPER 2POS 1MM PITCH THT]  (value not drawn)
J12  Jumper  [JUMPER 2POS 1MM PITCH THT]  (value not drawn)
J15  Jumper  [JUMPER 2POS 1MM PITCH THT]  (value not drawn)
K1  118-A-5/2D  [118-A-5/2D]
K2  118-A-5/2D  [118-A-5/2D]
K3  118-A-5/2D  [118-A-5/2D]
K4  118-A-5/2D  [118-A-5/2D]
K5  118-A-5/2D  [118-A-5/2D]
K6  118-A-5/2D  [118-A-5/2D]
K7  118-A-5/2D  [118-A-5/2D]
K8  118-A-5/2D  [118-A-5/2D]
Q1  DMG2302UK  [SOT90-3 LOW DENSITY]  (value not drawn)
Q2  DMG2302UK  [SOT90-3 LOW DENSITY]  (value not drawn)
Q3  DMG2302UK  [SOT90-3 LOW DENSITY]  (value not drawn)
Q4  DMG2302UK  [SOT90-3 LOW DENSITY]  (value not drawn)
R0  TBD  [RES 0603 IPC MID DENSITY]
R33  0R  [RES 0603 IPC MID DENSITY]
R36  47R  [RES 0603 IPC MID DENSITY]
R37  100k  [RES 0603 IPC MID DENSITY]
R38  47R  [RES 0603 IPC MID DENSITY]
R39  47R  [RES 0603 IPC MID DENSITY]
R40  100k  [RES 0603 IPC MID DENSITY]
R41  100k  [RES 0603 IPC MID DENSITY]
R42  47R  [RES 0603 IPC MID DENSITY]
R43  100k  [RES 0603 IPC MID DENSITY]
R45  1Meg  [RES 1206 IPC MID DENSITY]
R46  10k  [RES 1206 IPC MID DENSITY]
RT1  value NT 10K  [RES 0603 IPC MID DENSITY]  (hidden comment: NTC 0603 10K 1%)
TP7  Testpoint  [TESTPOINT THT]  (value not drawn)  (no BOM)
U9  DAC5311  [SOT363-6 MID DENSITY]
U13  OPA928DR  [8-SOIC 4MM WIDE MID DENSITY]

### Blocks framed on the sheet
GAIN SWITCHING: C31 J12 K5 K6 Q3 R42 R43 R46
OPTIONAL RC FILTER: C0 C00 R0 TP7
TEMPERATURE MONITORING: C32 RT1

### Ports
ACF_SW (in, see top_Soldier[4C], ADC_Soldier[4B]), ACF_SWA_IN (out, see top_Soldier[3C]), BRD_TMP (out, see top_Soldier[3C], ADC_Soldier[4B]), GAIN_SW (in, see top_Soldier[4C], ADC_Soldier[4B]), GUARD (bidir, see top_Soldier[3C], Integrators_Soldier[3B]), ISO_SPI_CS_BV (in, see top_Soldier[4C], BoardInterfaces_Soldier[5C]), ISO_SPI_MOSI (in, see top_Soldier[4C], BoardInterfaces_Soldier[5C]), ISO_SPI_SCLK (in, see top_Soldier[4C], BoardInterfaces_Soldier[5C]), IVC_SW (in, see top_Soldier[4C], ADC_Soldier[4B]), IVC_SW_IN (out, see top_Soldier[3C]), PD_TMP (out, see top_Soldier[3C], ADC_Soldier[4B]), TIA_OUT (out, see top_Soldier[3C], ADC_Soldier[2B]), TIA_SW (in, see top_Soldier[4C], ADC_Soldier[4B])

### Nets
4V9: C00.1 C0.1 C22.1 C23.1 D3.2(Anode) U9.5(GND) U13.1(IN+)
5VTIA: C28.2 C29.2 U13.5(V+)
10V: C22.2 C23.2 U9.4(AVDD)
A5VSW: K1.1 K2.1 K3.1 K4.1 K5.1 K6.1 K7.1 K8.1
GND: C28.1 C29.1 C32.1 J6.5 J6.6(SHLD) J10.1 J11.1 J12.1 J15.1 Q1.2(Source) Q2.2(Source) Q3.2(Source) Q4.2(Source) R37.2 R40.2 R41.2 R43.2 RT1.1 U13.4(V-)  [also labelled TMP_COM]  [project net SYS_GND]
ACF_RELAY_GND: J10.2 K1.2 K2.2 Q1.3(Drain)
ACF_SWA_IN: K2.3 ; port ACF_SWA_IN
GUARD: J6.4 U13.2(GRD_1) U13.7(GRD_2) ; port GUARD
IVC_RELAY_GND: J11.2 K3.2 K4.2 Q2.3(Drain)
IVC_SW_IN: K4.3 ; port IVC_SW_IN
PD_A: J4.1 J6.2 K1.3 K3.3 K7.3
PD_K: C0.2 D3.1(Cathode) J4.2 J4.3 J4.4 J4.5 J6.1 R0.2
TIA_GAIN_OUT: C31.2 K5.3 R46.2
TIA_GAIN_RELAY_GND: J12.2 K5.2 K6.2 Q3.3(Drain)
TIA_IN: C30.1 C31.1 K8.3 R45.1 R46.1 U13.8(IN-)
TIA_OUT: C30.2 K6.3 R45.2 U13.6(OUT) ; port TIA_OUT
TIA_RELAY_GND: J15.2 K7.2 K8.2 Q4.3(Drain)
VBIAS: R33.2 U9.6(VOUT)
NetC00_2: C00.2 R0.1 R33.1 TP7.1
NetC32_2: C32.2 RT1.2 ; port BRD_TMP
NetJ6_3: J6.3 ; port PD_TMP
NetK1_4: K1.4 K2.4
NetK3_4: K3.4 K4.4
NetK5_4: K5.4 K6.4
NetK7_4: K7.4 K8.4
NetQ1_1: Q1.1(Gate) R36.1 R37.1
NetQ2_1: Q2.1(Gate) R39.1 R40.1
NetQ3_1: Q3.1(Gate) R42.1 R43.1
NetQ4_1: Q4.1(Gate) R38.1 R41.1
NetR36_2: R36.2 ; port ACF_SW
NetR38_2: R38.2 ; port TIA_SW
NetR39_2: R39.2 ; port IVC_SW
NetR42_2: R42.2 ; port GAIN_SW
NetU9_1: U9.1(~{SYNC}) ; port ISO_SPI_CS_BV
NetU9_2: U9.2(SCLK) ; port ISO_SPI_SCLK
NetU9_3: U9.3(DIN) ; port ISO_SPI_MOSI

Not connected (* = marked no-connect by the designer): U13 3(DNC)*

### Notes on the sheet
- BIAS VOLTAGE
- CONFIGURATION
- DAC @{"Id":"VWWHWINY\NCSTVZIQ","ObjectType":2} sets SPI-controlled bias voltage for photodiode reverse-bias operation. Nominal 2.5V output. Current limit 10mA.
  AD5601 is a drop-in replacement for DAC5311 with slightly worse noise and linearity but identical pinout and interface. DAC5311 is preferred if available.
- (near C23) Per the AD5601 datasheet, @{"Id":"VWWHWINY\VDRCWQAZ","ObjectType":2} should be a tantalum capacitor. It is currently specified as an MLCC.
- @{"Id":"VWWHWINY\HADYNUVS","ObjectType":2} and @{"Id":"VWWHWINY\WCSUNDQM","ObjectType":2} add an impedance in parallel to @{"Id":"VWWHWINY\GOGLLSQO","ObjectType":2} and @{"Id":"VWWHWINY\PCCOMUXO","ObjectType":2} to lower the gain of the TIA, which measures the photocurrent in the case where the laser is not being pulsed.
- TRANSIMPEDANCE
- Added new relay pair for TIA isolation, and reduced the positive rail on the TIA to make it impossible for it to overvolt the ADC
- AMPLIFIER
- The TIA is powered in single-supply mode. This complicates the use of the integrators.
  In short, the TIA and the integrators must be at or near the same common-mode voltage. Furthermore, the integrators internally connect their common-mode voltage to what they perceive as ground. Previous revisions violated that by having the TIA at 4.9V and the integrators at 0V. Now, the integrators are moved up to treat 4.9V as a virtual ground.
  This is expected to have significantly less noise in the TIA signal compared to a dual-supply TIA.
- Calculation for the TIA stability capacitor:
  Feedback resistor value: R [Ohms] (Calculated above)
  Bandwidth of circuit: f [Hz]
  C = 1/(2pi R f) [F]
- (near C29) Place caps as close to the V+ terminal of the amp as possible
- NOTE: Feedback resistors must have EXTREMELY low thermal drift.
  Capacitors should have C0G/NP0 rating.
  Selected CF values are optimized for maximum stable bandwidth with the OPA928 (GBW=2.5MHz) driving the high input capacitance of the photodiode.
- AMPLIFIER SWITCHING
- If used, place RC filter as close as possible to the photodiode anode.
  Otherwise, DNP the capacitors and set R0 = 0 Ohms.
- Here, we expect the anode to be at 4.9V and the cathode to be somewhere between 4.9V and the maximum reverse-bias voltage.
- PHOTODIODE
- INPUT/OUTPUT
- (near J4) @{"Id":"VWWHWINY\QWWOJNVX","ObjectType":2} Photodiode protection Zener diode. Should only be placed if software cannot be trusted to operate the DAC safely. In that case, it should be populated with a Zener that will break down before the photodiode does, and paired with a current-limiting resistance in the RC filter. Most Zeners will have microamp scale leakage current. This acts as an additional source of shot noise that adds together with that from the photodiode dark current and limits measurement precision.
- GUARD ACF INTEGRATOR INPUT
- @{"Id":"VWWHWINY\NESASQVO","ObjectType":2} and @{"Id":"VWWHWINY\PBNPHMOD","ObjectType":2} allow photocurrent to reach the sergeant channel of the ACF integrator, which can give time-averaged photocurrent measurements for both the sergeant and the soldier photodiodes with nearly identical characteristics between the two.
- K
- A
- (near K4) (Same guard net)
- (near K4) GUARD IVC INTEGRATOR INPUT
- @{"Id":"VWWHWINY\RKAEHUYL","ObjectType":2} and @{"Id":"VWWHWINY\UNKFDRCR","ObjectType":2} allow photocurrent to reach the IVC integrator, which serves to validate the value read from the sergeant channel of the ACF.
- Board Temp Monitor
  - Placed near TIA
- The relays are paired and wired in series (such that the switch terminals are all Pin 3) for extremely low EMF
- Pickering 118-A-5/2D reed relays are used for much lower leakage current than solid-state switches while taking very little board space for relays.
- ALTAIR Photodiode Acquisition Payload - Soldier
- (Based on UVic ORCASat design Rev A.6 by Evan Moore)
- Relay coil resistance (i.e., between A5VSW and MOSFET drains) is 2.2k per relay (1.1k per pair).

### Library data of the parts
C00 C0 = CAP: Murata GRT188R61H105KE13D - Cap Ceramic 1uF 10% 50V X5R 0603 (Placeholder); MF: Murata; MP: GRT188R61H105KE13D
C22 C29 C32 = CAP: as C5 on sheet Power_Soldier; MF: Kemet; MP: C0603C104K5RACAUTO
C23 = CAP: as C1 on sheet Power_Soldier; MF: Murata; MP: GRT319R6YA106KE01D
C28 = CAP: as C9 on sheet Power_Soldier; MF: Murata; MP: GRT188R61H105KE13D
C30 = CAP: Wurth Elektronik 885012008037 - Cap Ceramic 10pF 5% 50V NP0 1206; MF: Wurth Elektronik; MP: 885012008037
C31 = CAP: Kemet C1206C301K5GACTU - Cap Ceramic 300pF 10% 50V NP0 1206; MF: Kemet; MP: C1206C301K5GACTU
D3 = Zener: DIODE ZENER SOD123; MF: onsemi; MP: MMSZ4679T1G
J4 = 60312002114503: Coaxial, SMA Female Jack, 50 Ohm, Through-Hole; MF: Wurth Elektronik; Datasheet Link: https://katalog.we-online.de/em/datasheet/60312002114503.pdf; Height: 9.56mm; MP: 60312002114503; Mouser Part Number: 710-60312002114503; Mouser Price/Stock: https://www.mouser.co.uk/ProductDetail/Wurth-Elektronik/60312002114503?qs=3jNSNtuqJTL%2FGpZA1FAOxw%3D%3D
J6 = USB-miniB: Conn Mini-USB RCP 5 POS Solder ST Thru-Hole 5 Terminal 1 Port; Number of Positions: 5; Gender: Female; MF: Amphenol Commercial; MP: UE25BE5510H; RoHS: Yes; Category: USB Connectors; Stock 1: 6446; Mount: Through Hole; Color: Black; Contact Material: Copper Alloy; Contact Plating: Gold; Number of Contacts: 5; Termination: PCB; Features: High Temperature; Lead Free: Lead Free; Flammability Rating: UL94 V-0; ComponentLink1URL: http://components.arrow.com/part/dataview/0323_00956300?src-supplier=Arrow+Europe; ComponentLink1Description: http://components.arrow.com/part/dataview/0323_00956300?src-supplier=Arrow+Europe; ComponentLink2URL: http://www.alliedelec.com/m/d/e7e3d7a920045eebbdef787e60d8b001.pdf?src-supplier=Allied+Electronics; ComponentLink2Description: http://www.alliedelec.com/m/d/e7e3d7a920045eebbdef787e60d8b001.pdf?src-supplier=Allied+Electronics; ComponentLink3URL: https://www.amphenolcanada.com/ProductSearch/drawings/AC/UE25BEX510X.pdf?src-supplier=Digi-Key; ComponentLink3Description: https://www.amphenolcanada.com/ProductSearch/drawings/AC/UE25BEX510X.pdf?src-supplier=Digi-Key; Supplier 1: Digi-Key; Supplier Part Number 1: UE25BE5510H-ND
J10-J12 J15 = Jumper 2POS: Header 2Pos THT 2.54mm Pitch; MF: Samtec Inc.; MP: TSW-101-23-G-D; Supplier 1: Digi-Key; Supplier Part Number 1: SAM1068-01-ND; Operating Temperature: -55°C ~ 125°C
K1-K8 = RELAY 118-A-5/2D: High coil resistance SIL/SIP Reed Relay 118-A-5/2D; MF: Pickering; MP: 118-1-A-5/2D
Q1-Q4 = NMOS DMG2302UK: DIODES INC. Power MOSFET, N Channel, 20 V, 2.8 A, 0.061 ohm, SOT-23, Surface Mount; MP: DMG2302UK-7; ComponentLink1URL: http://www.farnell.com/datasheets/2814387.pdf?src-supplier=Farnell; ComponentLink1Description: http://www.farnell.com/datasheets/2814387.pdf?src-supplier=Farnell; ComponentLink2URL: http://www.farnell.com/datasheets/2814387.pdf?src-supplier=Element14; ComponentLink2Description: http://www.farnell.com/datasheets/2814387.pdf?src-supplier=Element14; ComponentLink3URL: https://www.diodes.com/assets/Datasheets/DMG2302UK.pdf?src-supplier=Digi-Key; ComponentLink3Description: https://www.diodes.com/assets/Datasheets/DMG2302UK.pdf?src-supplier=Digi-Key; ComponentLink4URL: http://www.farnell.com/datasheets/2814387.pdf?src-supplier=Newark; ComponentLink4Description: http://www.farnell.com/datasheets/2814387.pdf?src-supplier=Newark; Supplier 1: Digi-Key; Supplier Part Number 1: DMG2302UK-7DICT-ND; MF: Diodes
R0 = RES: as R99 on sheet BoardInterfaces_Soldier; MF: YAGEO; MP: RC0402JR-070RL
R33 = RES: as R14 on sheet Power_Soldier; MP: CRCW06030000Z0EA
R36 R38 R39 R42 = RES: Vishay CRCW060347R0JNEA - Res 47Ohm 5% 1/8W SMD 0603; MF: Vishay Dale; MP: CRCW060347R0JNEA
R37 R40 R41 R43 = RES: as R34 on sheet Power_Soldier; MP: ERJ-3GEYJ104V
R45 = RES: Vishay TNPV12061M00BYEN - Res 1MOhm 0.1% 1/4W SMD 1206; MF: Vishay Dale; MP: TNPV12061M00BYEN
R46 = RES: Stackpole RNCF1206TKY10K0 - Res 10k 0.01% 1/4W SMD 1206; MF: Stackpole Electronics Inc.; MP: RNCF1206TKY10K0
RT1 = THERM_RES NTC 0603 10K 1%: THERMISTOR NTC 10KOHM 3380K 0603; MF: Murata; MP: NCU18XH103F60RB; RoHS: No; Category: Thermistors; Stock 1: 48580; Case/Package: 0603; Case Code (Metric): 1608; Case Code (Imperial): 0603; Min Operating Temperature: -40°C; Max Operating Temperature: 125°C; REACH SVHC: No SVHC; ComponentLink1URL: http://www.farnell.com/datasheets/2095755.pdf?src-supplier=Farnell; ComponentLink1Description: http://www.farnell.com/datasheets/2095755.pdf?src-supplier=Farnell; ComponentLink2URL: https://www.murata.com/en-us/products/productdata/8796836233246/L0770E.pdf?src-supplier=Digi-Key; ComponentLink2Description: https://www.murata.com/en-us/products/productdata/8796836233246/L0770E.pdf?src-supplier=Digi-Key; ComponentLink3URL: http://www.farnell.com/datasheets/2095755.pdf?src-supplier=Element14; ComponentLink3Description: http://www.farnell.com/datasheets/2095755.pdf?src-supplier=Element14; Supplier 1: Digi-Key; Supplier Part Number 1: 490-16279-1-ND
U9 = DAC5311: DAC 8bit 1 channel SPI Supply Reference Buffered Voltage; MF: Texas Instruments; MP: DAC5311IDCKR
U13 = OPA928DR: Op Amp, 36V, fA input, precision, e-trim; MF: Texas Instruments; Datasheet Link: https://www.ti.com/lit/ds/symlink/opa928.pdf?HQS=dis-mous-null-mousermode-dsf-pf-null-wwe&ts=1731036524091&ref_url=https%253A%252F%252Fwww.ti.com%252Fgeneral%252Fdocs%252Fsuppproductinfo.tsp%253FdistId%253D26%2526gotoUrl%253Dhttps%253A%252F%252Fwww.ti.com; Height: 1.75mm; MP: OPA928DR; Mouser Part Number: 595-OPA928DR; Mouser Price/Stock: https://www.mouser.co.uk/ProductDetail/Texas-Instruments/OPA928DR?qs=2wMNvWM5ZX5RgAZJHoeYSw%3D%3D; Arrow Part Number: OPA928DR; Arrow Price/Stock: null?region=nac